# EAGLE schematic hw_LM (EAGLE 7.6.0), part 2 of 3
## Sheet 4 of 9: S32 Signals
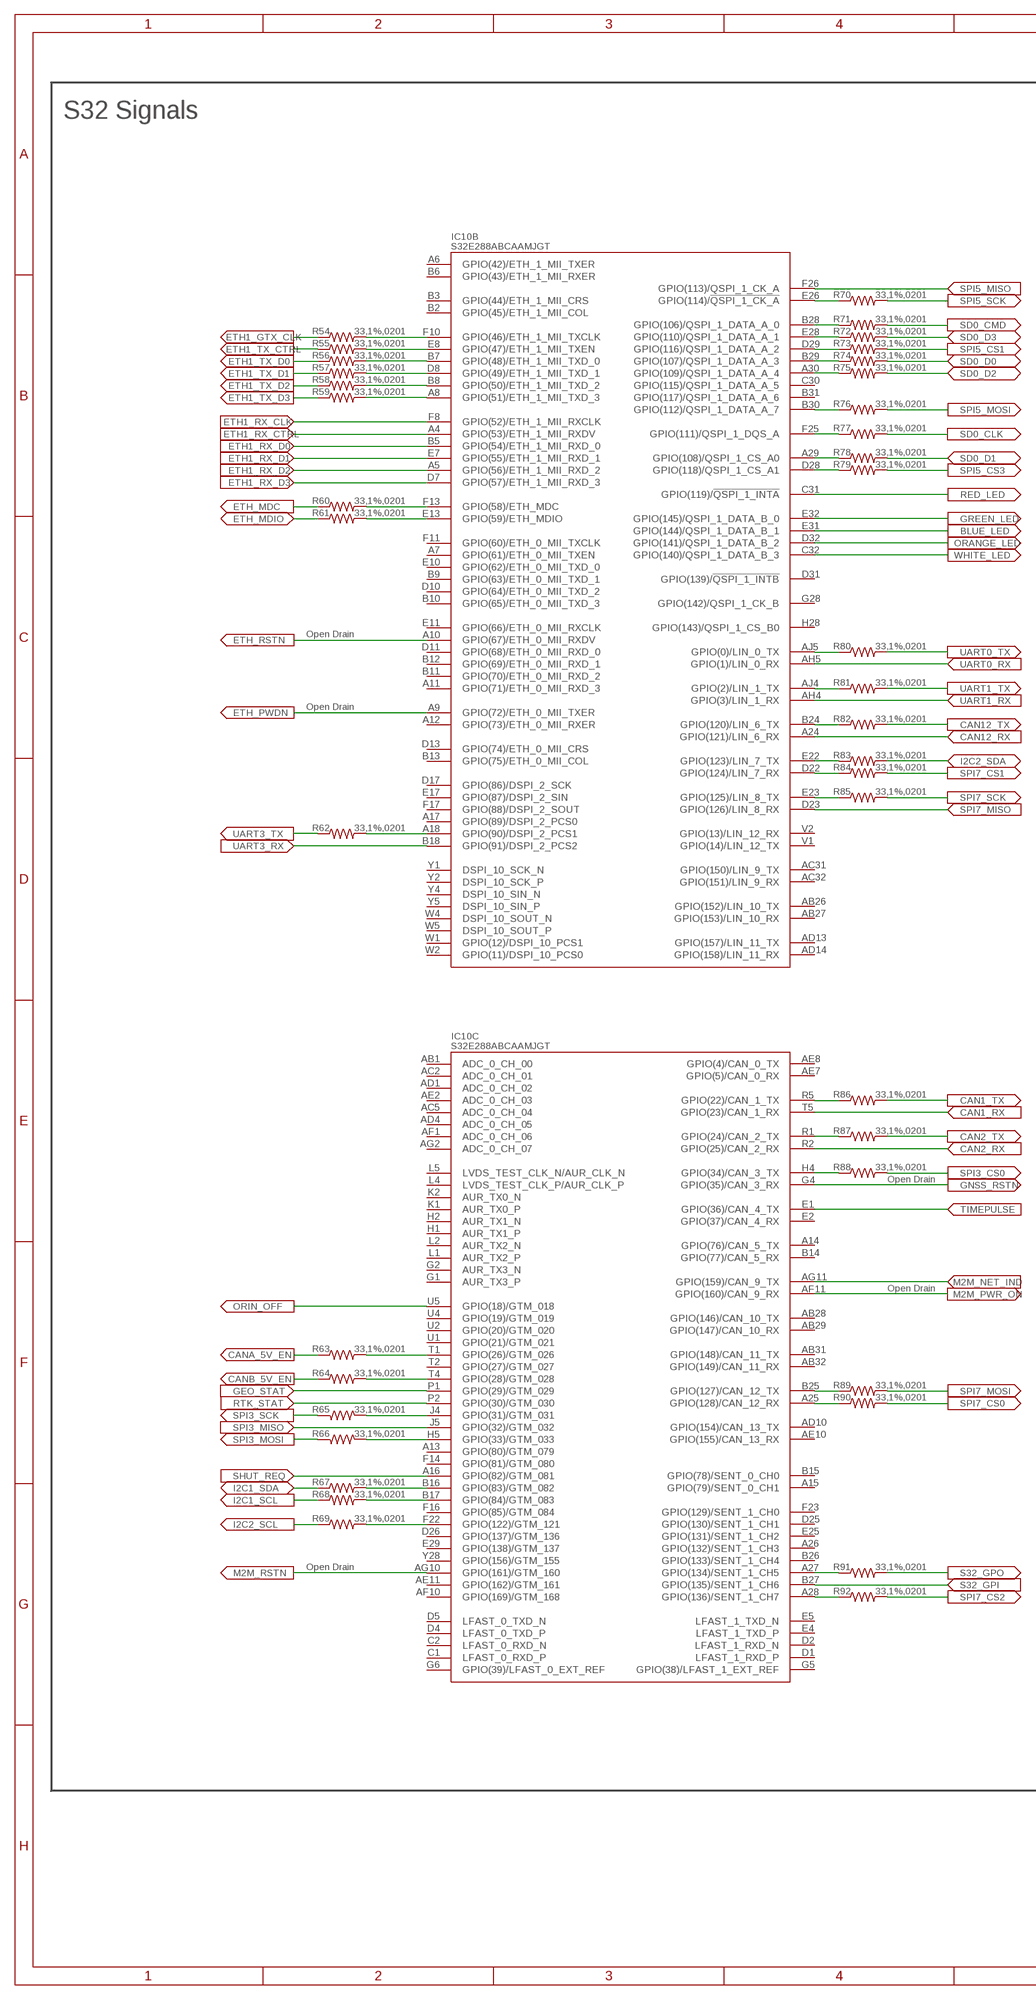
[diagram p5: schematic, sheet 4, part 1 of 2]
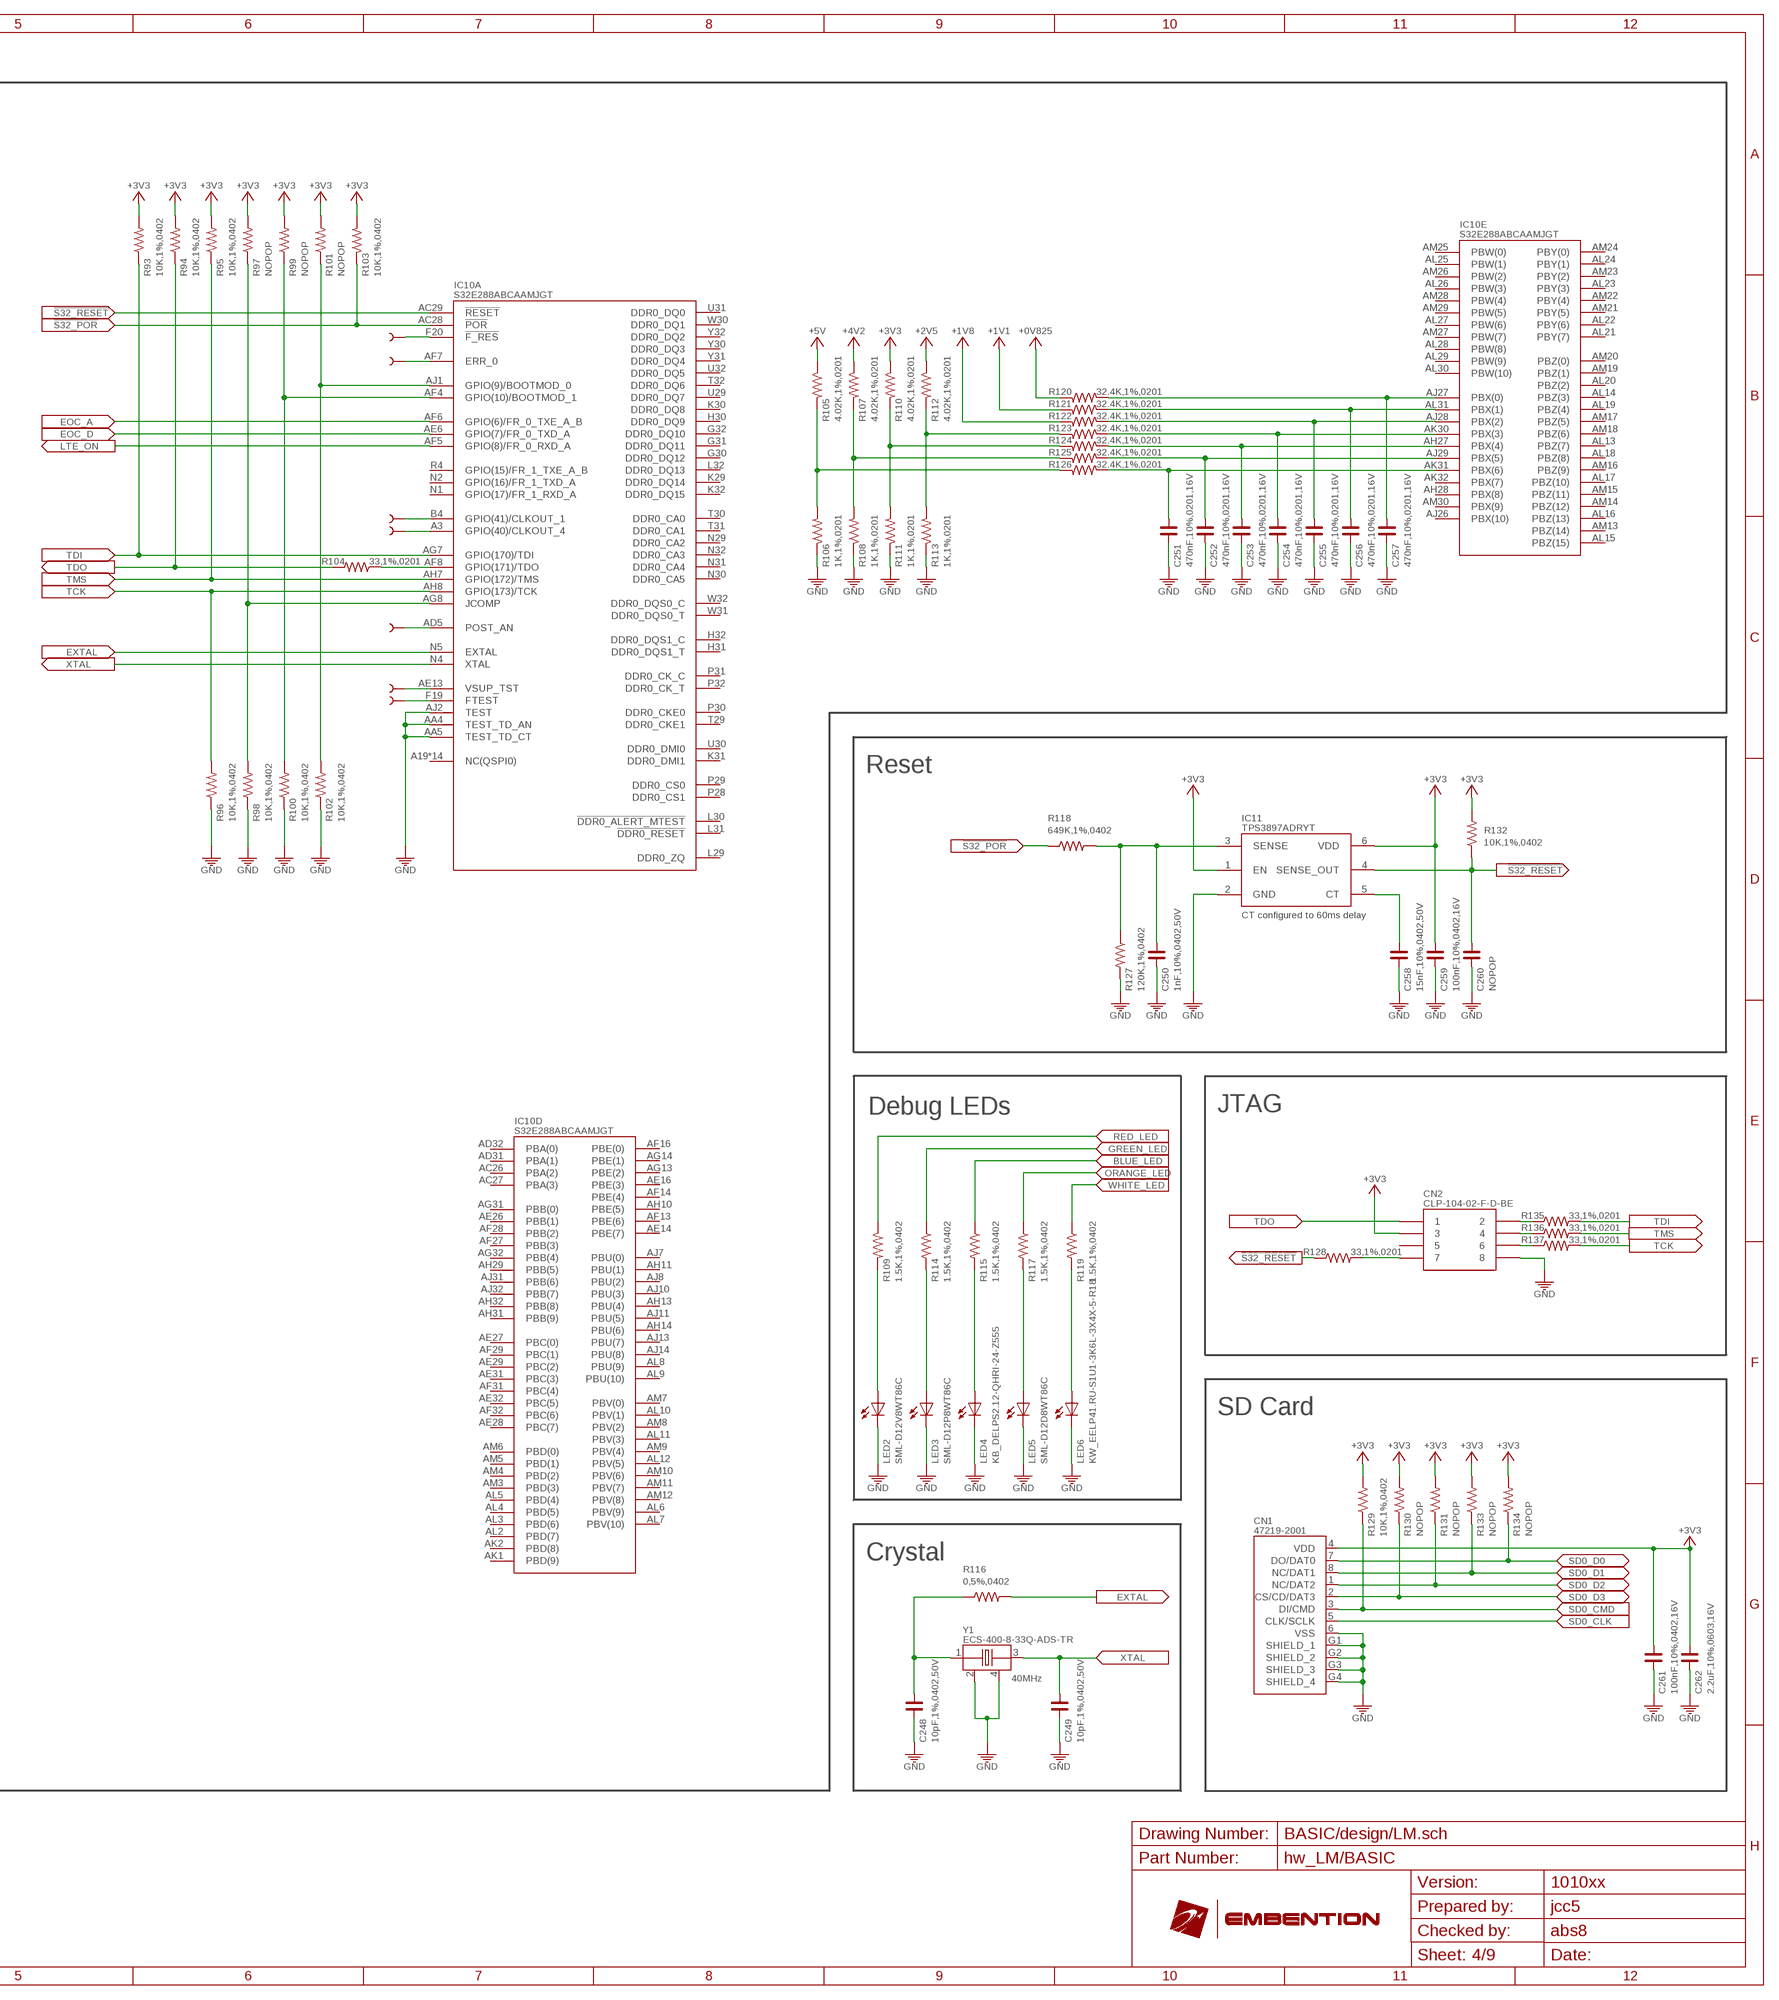
[diagram p6: schematic, sheet 4, part 2 of 2]

### Parts
C248  10pF,1%,0402,50V  C_0402  [C0402]
C249  10pF,1%,0402,50V  C_0402  [C0402]
C250  1nF,10%,0402,50V  C_0402  [C0402]
C251  470nF,10%,0201,16V  C_0201  [C0201]
C252  470nF,10%,0201,16V  C_0201  [C0201]
C253  470nF,10%,0201,16V  C_0201  [C0201]
C254  470nF,10%,0201,16V  C_0201  [C0201]
C255  470nF,10%,0201,16V  C_0201  [C0201]
C256  470nF,10%,0201,16V  C_0201  [C0201]
C257  470nF,10%,0201,16V  C_0201  [C0201]
C258  15nF,10%,0402,50V  C_0402  [C0402]
C259  100nF,10%,0402,16V  C_0402  [C0402]
C260  NOPOP  C_0402  [C0402]
C261  100nF,10%,0402,16V  C_0402  [C0402]
C262  2.2uF,10%,0603,16V  C_0603  [C0603]
CN1  47219-2001  SD-LATCH  [SD-LATCH]
CN2  CLP-104-02-F-D-BE  [CLP-104-02-X-D-BE]
IC11  TPS3897ADRYT  TPS3895ADRY  [USON6]
LED2  SML-D12V8WT86C  LED0603  [LED-0603]
LED3  SML-D12P8WT86C  LED0603  [LED-0603]
LED4  KB_DELPS2.12-QHRI-24-Z555  LED0603  [LED-0603]
LED5  SML-D12D8WT86C  LED0603  [LED-0603]
LED6  KW_EELP41.RU-S1U1-3K6L-3X4X-5-R18  LED0603  [LED-0603]
R54  33,1%,0201  R_0201  [R0201]
R55  33,1%,0201  R_0201  [R0201]
R56  33,1%,0201  R_0201  [R0201]
R57  33,1%,0201  R_0201  [R0201]
R58  33,1%,0201  R_0201  [R0201]
R59  33,1%,0201  R_0201  [R0201]
R60  33,1%,0201  R_0201  [R0201]
R61  33,1%,0201  R_0201  [R0201]
R62  33,1%,0201  R_0201  [R0201]
R63  33,1%,0201  R_0201  [R0201]
R64  33,1%,0201  R_0201  [R0201]
R65  33,1%,0201  R_0201  [R0201]
R66  33,1%,0201  R_0201  [R0201]
R67  33,1%,0201  R_0201  [R0201]
R68  33,1%,0201  R_0201  [R0201]
R69  33,1%,0201  R_0201  [R0201]
R70  33,1%,0201  R_0201  [R0201]
R71  33,1%,0201  R_0201  [R0201]
R72  33,1%,0201  R_0201  [R0201]
R73  33,1%,0201  R_0201  [R0201]
R74  33,1%,0201  R_0201  [R0201]
R75  33,1%,0201  R_0201  [R0201]
R76  33,1%,0201  R_0201  [R0201]
R77  33,1%,0201  R_0201  [R0201]
R78  33,1%,0201  R_0201  [R0201]
R79  33,1%,0201  R_0201  [R0201]
R80  33,1%,0201  R_0201  [R0201]
R81  33,1%,0201  R_0201  [R0201]
R82  33,1%,0201  R_0201  [R0201]
R83  33,1%,0201  R_0201  [R0201]
R84  33,1%,0201  R_0201  [R0201]
R85  33,1%,0201  R_0201  [R0201]
R86  33,1%,0201  R_0201  [R0201]
R87  33,1%,0201  R_0201  [R0201]
R88  33,1%,0201  R_0201  [R0201]
R89  33,1%,0201  R_0201  [R0201]
R90  33,1%,0201  R_0201  [R0201]
R91  33,1%,0201  R_0201  [R0201]
R92  33,1%,0201  R_0201  [R0201]
R93  10K,1%,0402  R_0402  [R0402]
R94  10K,1%,0402  R_0402  [R0402]
R95  10K,1%,0402  R_0402  [R0402]
R96  10K,1%,0402  R_0402  [R0402]
R97  NOPOP  R_0402  [R0402]
R98  10K,1%,0402  R_0402  [R0402]
R99  NOPOP  R_0402  [R0402]
R100  10K,1%,0402  R_0402  [R0402]
R101  NOPOP  R_0402  [R0402]
R102  10K,1%,0402  R_0402  [R0402]
R103  10K,1%,0402  R_0402  [R0402]
R104  33,1%,0201  R_0201  [R0201]
R105  4.02K,1%,0201  R_0201  [R0201]
R106  1K,1%,0201  R_0201  [R0201]
R107  4.02K,1%,0201  R_0201  [R0201]
R108  1K,1%,0201  R_0201  [R0201]
R109  1.5K,1%,0402  R_0402  [R0402]
R110  4.02K,1%,0201  R_0201  [R0201]
R111  1K,1%,0201  R_0201  [R0201]
R112  4.02K,1%,0201  R_0201  [R0201]
R113  1K,1%,0201  R_0201  [R0201]
R114  1.5K,1%,0402  R_0402  [R0402]
R115  1.5K,1%,0402  R_0402  [R0402]
R116  0,5%,0402  R_0402  [R0402]
R117  1.5K,1%,0402  R_0402  [R0402]
R118  649K,1%,0402  R_0402  [R0402]
R119  1.5K,1%,0402  R_0402  [R0402]
R120  32.4K,1%,0201  R_0201  [R0201]
R121  32.4K,1%,0201  R_0201  [R0201]
R122  32.4K,1%,0201  R_0201  [R0201]
R123  32.4K,1%,0201  R_0201  [R0201]
R124  32.4K,1%,0201  R_0201  [R0201]
R125  32.4K,1%,0201  R_0201  [R0201]
R126  32.4K,1%,0201  R_0201  [R0201]
R127  120K,1%,0402  R_0402  [R0402]
R128  33,1%,0201  R_0201  [R0201]
R129  10K,1%,0402  R_0402  [R0402]
R130  NOPOP  R_0402  [R0402]
R131  NOPOP  R_0402  [R0402]
R132  10K,1%,0402  R_0402  [R0402]
R133  NOPOP  R_0402  [R0402]
R134  NOPOP  R_0402  [R0402]
R135  33,1%,0201  R_0201  [R0201]
R136  33,1%,0201  R_0201  [R0201]
R137  33,1%,0201  R_0201  [R0201]
TP3  NOPOP  TEST-POINT2  [PAD.02X.02]
TP4  NOPOP  TEST-POINT2  [PAD.02X.02]
TP5  NOPOP  TEST-POINT2  [PAD.02X.02]
TP6  NOPOP  TEST-POINT2  [PAD.02X.02]
TP7  NOPOP  TEST-POINT2  [PAD.02X.02]
TP8  NOPOP  TEST-POINT2  [PAD.02X.02]
TP9  NOPOP  TEST-POINT2  [PAD.02X.02]
Y1  ECS-400-8-33Q-ADS-TR  ECS-250-18-33Q-DS-TR3  [ECS-250-18-33Q-DS-TR3]

### Nets
0V825_ADC: C257.1 IC10.AJ27(E:PBX(0)) R120.2
1V1_ADC: C256.1 IC10.AL31(E:PBX(1)) R121.2
1V8_ADC: C255.1 IC10.AJ28(E:PBX(2)) R122.2
2V5_ADC: C254.1 IC10.AK30(E:PBX(3)) R123.2
3V3_ADC: C253.1 IC10.AH27(E:PBX(4)) R124.2
4V2_ADC: C252.1 IC10.AJ29(E:PBX(5)) R125.2
5V_ADC: C251.1 IC10.AK31(E:PBX(6)) R126.2
!F_RES: IC10.F20(A:!F_RES) TP3.P$1
!S32_POR: IC10.AC28(A:!POR) R103.1 R118.1 ; also sheet 2
!S32_RESET: C260.1 IC10.AC29(A:!RESET) IC11.4(SENSE_OUT) R128.1 R132.1
+0V825: R120.1 ; also sheet 2,3
+1V1: R121.1 ; also sheet 2,3,6
+1V8: R122.1 ; also sheet 2,3,5,6
+2V5: R112.1 ; also sheet 2,6
+3V3: C259.1 C261.1 C262.1 CN1.4(VDD) CN2.3 IC11.1(EN) IC11.6(VDD) R93.2 R94.2 R95.2 R97.2 R99.2 R101.2 R103.2 R110.1 R129.2 R130.2 R131.2 R132.2 R133.2 R134.2 ; also sheet 2,3,5,7,8,9
+4V2: R107.1 ; also sheet 2,8
+5V: R105.1 ; also sheet 2,5,7,8
BLUE_LED: IC10.E31(B:GPIO(144)/QSPI_1_DATA_B_1) R115.1
BOOTMOD_0: IC10.AJ1(A:GPIO(9)/BOOTMOD_0) R101.1 R102.2
BOOTMOD_1: IC10.AF4(A:GPIO(10)/BOOTMOD_1) R99.1 R100.2
CAN1_RX: IC10.T5(C:GPIO(23)/CAN_1_RX) ; also sheet 7
CAN1_TX: R86.2 ; also sheet 7
CAN2_RX: IC10.R2(C:GPIO(25)/CAN_2_RX) ; also sheet 7
CAN2_TX: R87.2 ; also sheet 7
CAN12_RX: IC10.A24(B:GPIO(121)/LIN_6_RX) ; also sheet 7
CAN12_TX: R82.2 ; also sheet 7
CANA_5V_EN: R63.1 ; also sheet 7
CANB_5V_EN: R64.1 ; also sheet 7
CLKOUT_1: IC10.B4(A:GPIO(41)/CLKOUT_1) TP5.P$1
CLKOUT_4: IC10.A3(A:GPIO(40)/CLKOUT_4) TP6.P$1
EOC_A: IC10.AF6(A:GPIO(6)/FR_0_TXE_A_B) ; also sheet 9
EOC_D: IC10.AE6(A:GPIO(7)/FR_0_TXD_A) ; also sheet 9
ERR_0: IC10.AF7(A:ERR_0) TP4.P$1
ETH1_GTX_CLK [50R]: R54.1 ; also sheet 6
ETH1_RX_CLK [50R]: IC10.F8(B:GPIO(52)/ETH_1_MII_RXCLK) ; also sheet 6
ETH1_RX_CTRL [50R]: IC10.A4(B:GPIO(53)/ETH_1_MII_RXDV) ; also sheet 6
ETH1_RX_D0 [50R]: IC10.B5(B:GPIO(54)/ETH_1_MII_RXD_0) ; also sheet 6
ETH1_RX_D1 [50R]: IC10.E7(B:GPIO(55)/ETH_1_MII_RXD_1) ; also sheet 6
ETH1_RX_D2 [50R]: IC10.A5(B:GPIO(56)/ETH_1_MII_RXD_2) ; also sheet 6
ETH1_RX_D3 [50R]: IC10.D7(B:GPIO(57)/ETH_1_MII_RXD_3) ; also sheet 6
ETH1_TX_CTRL [50R]: R55.1 ; also sheet 6
ETH1_TX_D0 [50R]: R56.1 ; also sheet 6
ETH1_TX_D1 [50R]: R57.1 ; also sheet 6
ETH1_TX_D2 [50R]: R58.1 ; also sheet 6
ETH1_TX_D3 [50R]: R59.1 ; also sheet 6
ETH_MDC: R60.1 ; also sheet 6
ETH_MDIO: R61.1 ; also sheet 6
ETH_PWDN: IC10.A9(B:GPIO(72)/ETH_0_MII_TXER) ; also sheet 6
ETH_RSTN: IC10.A10(B:GPIO(67)/ETH_0_MII_RXDV) ; also sheet 6
EXTAL: IC10.N5(A:EXTAL) R116.2
FTEST: IC10.F19(A:FTEST) TP9.P$1
GEO_STAT: IC10.P1(C:GPIO(29)/GTM_029) ; also sheet 8
GND: C248.2 C249.2 C250.2 C251.2 C252.2 C253.2 C254.2 C255.2 C256.2 C257.2 C258.2 C259.2 C260.2 C261.2 C262.2 CN1.6(VSS) CN1.G1(SHIELD_1) CN1.G2(SHIELD_2) CN1.G3(SHIELD_3) CN1.G4(SHIELD_4) CN2.8 IC10.AA4(A:TEST_TD_AN) IC10.AA5(A:TEST_TD_CT) IC10.AJ2(A:TEST) IC11.2(GND) LED2.C LED3.C LED4.C LED5.C LED6.C R96.1 R98.1 R100.1 R102.1 R106.1 R108.1 R111.1 R113.1 R127.2 Y1.2(GND_2) Y1.4(GND_4) ; also sheet 1,2,3,5,6,7,8,9
GNSS_RSTN: IC10.G4(C:GPIO(35)/CAN_3_RX) ; also sheet 8
GPIO0: IC10.AJ5(B:GPIO(0)/LIN_0_TX) R80.1
GPIO2: IC10.AJ4(B:GPIO(2)/LIN_1_TX) R81.1
GPIO22: IC10.R5(C:GPIO(22)/CAN_1_TX) R86.1
GPIO24: IC10.R1(C:GPIO(24)/CAN_2_TX) R87.1
GPIO26: IC10.T1(C:GPIO(26)/GTM_026) R63.2
GPIO28: IC10.T4(C:GPIO(28)/GTM_028) R64.2
GPIO31: IC10.J4(C:GPIO(31)/GTM_031) R65.2
GPIO33: IC10.H5(C:GPIO(33)/GTM_033) R66.2
GPIO34: IC10.H4(C:GPIO(34)/CAN_3_TX) R88.1
GPIO46 [50R]: IC10.F10(B:GPIO(46)/ETH_1_MII_TXCLK) R54.2
GPIO47 [50R]: IC10.E8(B:GPIO(47)/ETH_1_MII_TXEN) R55.2
GPIO48 [50R]: IC10.B7(B:GPIO(48)/ETH_1_MII_TXD_0) R56.2
GPIO49 [50R]: IC10.D8(B:GPIO(49)/ETH_1_MII_TXD_1) R57.2
GPIO50 [50R]: IC10.B8(B:GPIO(50)/ETH_1_MII_TXD_2) R58.2
GPIO51 [50R]: IC10.A8(B:GPIO(51)/ETH_1_MII_TXD_3) R59.2
GPIO58: IC10.F13(B:GPIO(58)/ETH_MDC) R60.2
GPIO59: IC10.E13(B:GPIO(59)/ETH_MDIO) R61.2
GPIO83: IC10.B16(C:GPIO(83)/GTM_082) R67.2
GPIO84: IC10.B17(C:GPIO(84)/GTM_083) R68.2
GPIO90: IC10.A18(B:GPIO(90)/DSPI_2_PCS1) R62.2
GPIO106: IC10.B28(B:GPIO(106)/QSPI_1_DATA_A_0) R71.1
GPIO107: IC10.B29(B:GPIO(107)/QSPI_1_DATA_A_3) R74.1
GPIO108: IC10.A29(B:GPIO(108)/QSPI_1_CS_A0) R78.1
GPIO109: IC10.A30(B:GPIO(109)/QSPI_1_DATA_A_4) R75.1
GPIO110: IC10.E28(B:GPIO(110)/QSPI_1_DATA_A_1) R72.1
GPIO111: IC10.F25(B:GPIO(111)/QSPI_1_DQS_A) R77.1
GPIO112: IC10.B30(B:GPIO(112)/QSPI_1_DATA_A_7) R76.1
GPIO114: IC10.E26(B:GPIO(114)/!QSPI_1_CK_A) R70.1
GPIO116: IC10.D29(B:GPIO(116)/QSPI_1_DATA_A_2) R73.1
GPIO118: IC10.D28(B:GPIO(118)/QSPI_1_CS_A1) R79.1
GPIO120: IC10.B24(B:GPIO(120)/LIN_6_TX) R82.1
GPIO122: IC10.F22(C:GPIO(122)/GTM_121) R69.2
GPIO123: IC10.E22(B:GPIO(123)/LIN_7_TX) R83.1
GPIO124: IC10.D22(B:GPIO(124)/LIN_7_RX) R84.1
GPIO125: IC10.E23(B:GPIO(125)/LIN_8_TX) R85.1
GPIO127: IC10.B25(C:GPIO(127)/CAN_12_TX) R89.1
GPIO128: IC10.A25(C:GPIO(128)/CAN_12_RX) R90.1
GPIO134: IC10.A27(C:GPIO(134)/SENT_1_CH5) R91.1
GPIO136: IC10.A28(C:GPIO(136)/SENT_1_CH7) R92.1
GPIO171: IC10.AF8(A:GPIO(171)/TDO) R104.2
GREEN_LED: IC10.E32(B:GPIO(145)/QSPI_1_DATA_B_0) R114.1
I2C1_SCL: R68.1 ; also sheet 9
I2C1_SDA: R67.1 ; also sheet 9
I2C2_SCL: R69.1 ; also sheet 9
I2C2_SDA: R83.2 ; also sheet 9
JCOMP: IC10.AG8(A:JCOMP) R97.1 R98.2
JRSTN: CN2.7 R128.2
JTCK: CN2.6 R137.1
JTDI: CN2.2 R135.1
JTMS: CN2.4 R136.1
LTE_ON: IC10.AF5(A:GPIO(8)/FR_0_RXD_A) ; also sheet 2
M2M_NET_IND: IC10.AG11(C:GPIO(159)/CAN_9_TX) ; also sheet 8
M2M_PWR_ON: IC10.AF11(C:GPIO(160)/CAN_9_RX) ; also sheet 8
M2M_RSTN: IC10.AG10(C:GPIO(161)/GTM_160) ; also sheet 8
N$9: R112.2 R113.2 R123.1
N$35: R107.2 R108.2 R125.1
N$135: LED2.A R109.2
N$142: LED3.A R114.2
N$240: LED4.A R115.2
N$241: R110.2 R111.2 R124.1
N$716: C250.1 IC11.3(SENSE) R118.2 R127.1
N$728: C258.1 IC11.5(CT)
N$769: C248.1 R116.1 Y1.1(Q_1)
N$1161: LED5.A R117.2
N$1162: LED6.A R119.2
N$1165: R105.2 R106.2 R126.1
ORANGE_LED: IC10.D32(B:GPIO(141)/QSPI_1_DATA_B_2) R117.1
ORIN_OFF: IC10.U5(C:GPIO(18)/GTM_018) ; also sheet 2
POST_AN: IC10.AD5(A:POST_AN) TP7.P$1
RED_LED: IC10.C31(B:GPIO(119)/!QSPI_1_INTA) R109.1
RTK_STAT: IC10.P2(C:GPIO(30)/GTM_030) ; also sheet 8
S32_GPI: IC10.B27(C:GPIO(135)/SENT_1_CH6) ; also sheet 5
S32_GPO: R91.2 ; also sheet 5
SD0_CLK: CN1.5(CLK/SCLK) R77.2
SD0_CMD: CN1.3(DI/CMD) R71.2 R129.1
SD0_D0: CN1.7(DO/DAT0) R74.2 R134.1
SD0_D1: CN1.8(NC/DAT1) R78.2 R133.1
SD0_D2: CN1.1(NC/DAT2) R75.2 R131.1
SD0_D3: CN1.2(CS/CD/DAT3) R72.2 R130.1
SHUT_REQ: IC10.A16(C:GPIO(82)/GTM_081) ; also sheet 5
SPI3_CS0: R88.2 ; also sheet 8
SPI3_MISO: IC10.J5(C:GPIO(32)/GTM_032) ; also sheet 8
SPI3_MOSI: R66.1 ; also sheet 8
SPI3_SCK: R65.1 ; also sheet 8
SPI5_CS1: R73.2 ; also sheet 9
SPI5_CS3: R79.2 ; also sheet 9
SPI5_MISO: IC10.F26(B:GPIO(113)/QSPI_1_CK_A) ; also sheet 9
SPI5_MOSI: R76.2 ; also sheet 9
SPI5_SCK: R70.2 ; also sheet 9
SPI7_CS0: R90.2 ; also sheet 9
SPI7_CS1: R84.2 ; also sheet 9
SPI7_CS2: R92.2 ; also sheet 9
SPI7_MISO: IC10.D23(B:GPIO(126)/LIN_8_RX) ; also sheet 9
SPI7_MOSI: R89.2 ; also sheet 9
SPI7_SCK: R85.2 ; also sheet 9
TCK: IC10.AH8(A:GPIO(173)/TCK) R96.2 R137.2
TDI: IC10.AG7(A:GPIO(170)/TDI) R93.1 R135.2
TDO: CN2.1 R94.1 R104.1
TIMEPULSE: IC10.E1(C:GPIO(36)/CAN_4_TX) ; also sheet 8
TMS: IC10.AH7(A:GPIO(172)/TMS) R95.1 R136.2
UART0_RX: IC10.AH5(B:GPIO(1)/LIN_0_RX) ; also sheet 8
UART0_TX: R80.2 ; also sheet 8
UART1_RX: IC10.AH4(B:GPIO(3)/LIN_1_RX) ; also sheet 8
UART1_TX: R81.2 ; also sheet 8
UART3_RX: IC10.B18(B:GPIO(91)/DSPI_2_PCS2) ; also sheet 5
UART3_TX: R62.1 ; also sheet 5
VSUP_TST: IC10.AE13(A:VSUP_TST) TP8.P$1
WHITE_LED: IC10.C32(B:GPIO(140)/QSPI_1_DATA_B_3) R119.1
XTAL: C249.1 IC10.N4(A:XTAL) Y1.3(Q_3)
Unconnected: CN2.5 IC10.A6(B:GPIO(42)/ETH_1_MII_TXER) IC10.A7(B:GPIO(61)/ETH_0_MII_TXEN) IC10.A11(B:GPIO(71)/ETH_0_MII_RXD_3) IC10.A12(B:GPIO(73)/ETH_0_MII_RXER) IC10.A13(C:GPIO(80)/GTM_079) IC10.A14(C:GPIO(76)/CAN_5_TX) IC10.A15(C:GPIO(79)/SENT_0_CH1) IC10.A17(B:GPIO(89)/DSPI_2_PCS0) IC10.A19(A:NC(QSPI0)) IC10.A20(A:NC(QSPI0)) IC10.A21(A:NC(QSPI0)) IC10.A22(A:NC(QSPI0)) IC10.A23(A:NC(QSPI0)) IC10.A26(C:GPIO(132)/SENT_1_CH3) IC10.AB1(C:ADC_0_CH_00) IC10.AB26(B:GPIO(152)/LIN_10_TX) IC10.AB27(B:GPIO(153)/LIN_10_RX) IC10.AB28(C:GPIO(146)/CAN_10_TX) IC10.AB29(C:GPIO(147)/CAN_10_RX) IC10.AB31(C:GPIO(148)/CAN_11_TX) IC10.AB32(C:GPIO(149)/CAN_11_RX) IC10.AC2(C:ADC_0_CH_01) IC10.AC5(C:ADC_0_CH_04) IC10.AC26(D:PBA(2)) IC10.AC27(D:PBA(3)) IC10.AC31(B:GPIO(150)/LIN_9_TX) IC10.AC32(B:GPIO(151)/LIN_9_RX) IC10.AD1(C:ADC_0_CH_02) IC10.AD4(C:ADC_0_CH_05) IC10.AD10(C:GPIO(154)/CAN_13_TX) IC10.AD13(B:GPIO(157)/LIN_11_TX) IC10.AD14(B:GPIO(158)/LIN_11_RX) IC10.AD31(D:PBA(1)) IC10.AD32(D:PBA(0)) IC10.AE2(C:ADC_0_CH_03) IC10.AE7(C:GPIO(5)/CAN_0_RX) IC10.AE8(C:GPIO(4)/CAN_0_TX) IC10.AE10(C:GPIO(155)/CAN_13_RX) IC10.AE11(C:GPIO(162)/GTM_161) IC10.AE14(D:PBE(7)) IC10.AE16(D:PBE(3)) IC10.AE26(D:PBB(1)) IC10.AE27(D:PBC(0)) IC10.AE28(D:PBC(7)) IC10.AE29(D:PBC(2)) IC10.AE31(D:PBC(3)) IC10.AE32(D:PBC(5)) IC10.AF1(C:ADC_0_CH_06) IC10.AF10(C:GPIO(169)/GTM_168) IC10.AF13(D:PBE(6)) IC10.AF14(D:PBE(4)) IC10.AF16(D:PBE(0)) IC10.AF27(D:PBB(3)) IC10.AF28(D:PBB(2)) IC10.AF29(D:PBC(1)) IC10.AF31(D:PBC(4)) IC10.AF32(D:PBC(6)) IC10.AG2(C:ADC_0_CH_07) IC10.AG13(D:PBE(2)) IC10.AG14(D:PBE(1)) IC10.AG31(D:PBB(0)) IC10.AG32(D:PBB(4)) IC10.AH10(D:PBE(5)) IC10.AH11(D:PBU(1)) IC10.AH13(D:PBU(4)) IC10.AH14(D:PBU(6)) IC10.AH28(E:PBX(8)) IC10.AH29(D:PBB(5)) IC10.AH31(D:PBB(9)) IC10.AH32(D:PBB(8)) IC10.AJ7(D:PBU(0)) IC10.AJ8(D:PBU(2)) IC10.AJ10(D:PBU(3)) IC10.AJ11(D:PBU(5)) IC10.AJ13(D:PBU(7)) IC10.AJ14(D:PBU(8)) IC10.AJ26(E:PBX(10)) IC10.AJ31(D:PBB(6)) IC10.AJ32(D:PBB(7)) IC10.AK1(D:PBD(9)) IC10.AK2(D:PBD(8)) IC10.AK32(E:PBX(7)) IC10.AL2(D:PBD(7)) IC10.AL3(D:PBD(6)) IC10.AL4(D:PBD(5)) IC10.AL5(D:PBD(4)) IC10.AL6(D:PBV(9)) IC10.AL7(D:PBV(10)) IC10.AL8(D:PBU(9)) IC10.AL9(D:PBU(10)) IC10.AL10(D:PBV(1)) IC10.AL11(D:PBV(3)) IC10.AL12(D:PBV(5)) IC10.AL13(E:PBZ(7)) IC10.AL14(E:PBZ(3)) IC10.AL15(E:PBZ(15)) IC10.AL16(E:PBZ(13)) IC10.AL17(E:PBZ(10)) IC10.AL18(E:PBZ(8)) IC10.AL19(E:PBZ(4)) IC10.AL20(E:PBZ(2)) IC10.AL21(E:PBY(7)) IC10.AL22(E:PBY(6)) IC10.AL23(E:PBY(3)) IC10.AL24(E:PBY(1)) IC10.AL25(E:PBW(1)) IC10.AL26(E:PBW(3)) IC10.AL27(E:PBW(6)) IC10.AL28(E:PBW(8)) IC10.AL29(E:PBW(9)) IC10.AL30(E:PBW(10)) IC10.AM3(D:PBD(3)) IC10.AM4(D:PBD(2)) IC10.AM5(D:PBD(1)) IC10.AM6(D:PBD(0)) IC10.AM7(D:PBV(0)) IC10.AM8(D:PBV(2)) IC10.AM9(D:PBV(4)) IC10.AM10(D:PBV(6)) IC10.AM11(D:PBV(7)) IC10.AM12(D:PBV(8)) IC10.AM13(E:PBZ(14)) IC10.AM14(E:PBZ(12)) IC10.AM15(E:PBZ(11)) IC10.AM16(E:PBZ(9)) IC10.AM17(E:PBZ(5)) IC10.AM18(E:PBZ(6)) IC10.AM19(E:PBZ(1)) IC10.AM20(E:PBZ(0)) IC10.AM21(E:PBY(5)) IC10.AM22(E:PBY(4)) IC10.AM23(E:PBY(2)) IC10.AM24(E:PBY(0)) IC10.AM25(E:PBW(0)) IC10.AM26(E:PBW(2)) IC10.AM27(E:PBW(7)) IC10.AM28(E:PBW(4)) IC10.AM29(E:PBW(5)) IC10.AM30(E:PBX(9)) IC10.B2(B:GPIO(45)/ETH_1_MII_COL) IC10.B3(B:GPIO(44)/ETH_1_MII_CRS) IC10.B6(B:GPIO(43)/ETH_1_MII_RXER) IC10.B9(B:GPIO(63)/ETH_0_MII_TXD_1) IC10.B10(B:GPIO(65)/ETH_0_MII_TXD_3) IC10.B11(B:GPIO(70)/ETH_0_MII_RXD_2) IC10.B12(B:GPIO(69)/ETH_0_MII_RXD_1) IC10.B13(B:GPIO(75)/ETH_0_MII_COL) IC10.B14(C:GPIO(77)/CAN_5_RX) IC10.B15(C:GPIO(78)/SENT_0_CH0) IC10.B19(A:NC(QSPI0)) IC10.B20(A:NC(QSPI0)) IC10.B21(A:NC(QSPI0)) IC10.B22(A:NC(QSPI0)) IC10.B23(A:NC(QSPI0)) IC10.B26(C:GPIO(133)/SENT_1_CH4) IC10.B31(B:GPIO(117)/QSPI_1_DATA_A_6) IC10.C1(C:LFAST_0_RXD_P) IC10.C2(C:LFAST_0_RXD_N) IC10.C30(B:GPIO(115)/QSPI_1_DATA_A_5) IC10.D1(C:LFAST_1_RXD_P) IC10.D2(C:LFAST_1_RXD_N) IC10.D4(C:LFAST_0_TXD_P) IC10.D5(C:LFAST_0_TXD_N) IC10.D10(B:GPIO(64)/ETH_0_MII_TXD_2) IC10.D11(B:GPIO(68)/ETH_0_MII_RXD_0) IC10.D13(B:GPIO(74)/ETH_0_MII_CRS) IC10.D17(B:GPIO(86)/DSPI_2_SCK) IC10.D19(A:NC(QSPI0)) IC10.D20(A:NC(QSPI0)) IC10.D25(C:GPIO(130)/SENT_1_CH1) IC10.D26(C:GPIO(137)/GTM_136) IC10.D31(B:GPIO(139)/!QSPI_1_INTB) IC10.E2(C:GPIO(37)/CAN_4_RX) IC10.E4(C:LFAST_1_TXD_P) IC10.E5(C:LFAST_1_TXD_N) IC10.E10(B:GPIO(62)/ETH_0_MII_TXD_0) IC10.E11(B:GPIO(66)/ETH_0_MII_RXCLK) IC10.E17(B:GPIO(87)/DSPI_2_SIN) IC10.E19(A:NC(QSPI0)) IC10.E20(A:NC(QSPI0)) IC10.E25(C:GPIO(131)/SENT_1_CH2) IC10.E29(C:GPIO(138)/GTM_137) IC10.F11(B:GPIO(60)/ETH_0_MII_TXCLK) IC10.F14(C:GPIO(81)/GTM_080) IC10.F16(C:GPIO(85)/GTM_084) IC10.F17(B:GPIO(88)/DSPI_2_SOUT) IC10.F23(C:GPIO(129)/SENT_1_CH0) IC10.G1(C:AUR_TX3_P) IC10.G2(C:AUR_TX3_N) IC10.G5(C:GPIO(38)/LFAST_1_EXT_REF) IC10.G6(C:GPIO(39)/LFAST_0_EXT_REF) IC10.G28(B:GPIO(142)/QSPI_1_CK_B) IC10.G30(A:DDR0_DQ12) IC10.G31(A:DDR0_DQ11) IC10.G32(A:DDR0_DQ10) IC10.H1(C:AUR_TX1_P) IC10.H2(C:AUR_TX1_N) IC10.H28(B:GPIO(143)/QSPI_1_CS_B0) IC10.H30(A:DDR0_DQ9) IC10.H31(A:DDR0_DQS1_T) IC10.H32(A:DDR0_DQS1_C) IC10.K1(C:AUR_TX0_P) IC10.K2(C:AUR_TX0_N) IC10.K29(A:DDR0_DQ14) IC10.K30(A:DDR0_DQ8) IC10.K31(A:DDR0_DMI1) IC10.K32(A:DDR0_DQ15) IC10.L1(C:AUR_TX2_P) IC10.L2(C:AUR_TX2_N) IC10.L4(C:LVDS_TEST_CLK_P/AUR_CLK_P) IC10.L5(C:LVDS_TEST_CLK_N/AUR_CLK_N) IC10.L29(A:DDR0_ZQ) IC10.L30(A:!DDR0_ALERT_MTEST) IC10.L31(A:!DDR0_RESET) IC10.L32(A:DDR0_DQ13) IC10.N1(A:GPIO(17)/FR_1_RXD_A) IC10.N2(A:GPIO(16)/FR_1_TXD_A) IC10.N29(A:DDR0_CA2) IC10.N30(A:DDR0_CA5) IC10.N31(A:DDR0_CA4) IC10.N32(A:DDR0_CA3) IC10.P28(A:DDR0_CS1) IC10.P29(A:DDR0_CS0) IC10.P30(A:DDR0_CKE0) IC10.P31(A:DDR0_CK_C) IC10.P32(A:DDR0_CK_T) IC10.R4(A:GPIO(15)/FR_1_TXE_A_B) IC10.T2(C:GPIO(27)/GTM_027) IC10.T29(A:DDR0_CKE1) IC10.T30(A:DDR0_CA0) IC10.T31(A:DDR0_CA1) IC10.T32(A:DDR0_DQ6) IC10.U1(C:GPIO(21)/GTM_021) IC10.U2(C:GPIO(20)/GTM_020) IC10.U4(C:GPIO(19)/GTM_019) IC10.U29(A:DDR0_DQ7) IC10.U30(A:DDR0_DMI0) IC10.U31(A:DDR0_DQ0) IC10.U32(A:DDR0_DQ5) IC10.V1(B:GPIO(14)/LIN_12_TX) IC10.V2(B:GPIO(13)/LIN_12_RX) IC10.W1(B:GPIO(12)/DSPI_10_PCS1) IC10.W2(B:GPIO(11)/DSPI_10_PCS0) IC10.W4(B:DSPI_10_SOUT_N) IC10.W5(B:DSPI_10_SOUT_P) IC10.W30(A:DDR0_DQ1) IC10.W31(A:DDR0_DQS0_T) IC10.W32(A:DDR0_DQS0_C) IC10.Y1(B:DSPI_10_SCK_N) IC10.Y2(B:DSPI_10_SCK_P) IC10.Y4(B:DSPI_10_SIN_N) IC10.Y5(B:DSPI_10_SIN_P) IC10.Y28(C:GPIO(156)/GTM_155) IC10.Y30(A:DDR0_DQ3) IC10.Y31(A:DDR0_DQ4) IC10.Y32(A:DDR0_DQ2)

### Notes on the sheet
- S32 Signals
- Open Drain
- Open Drain
- Reset
- CT configured to 60ms delay
- Debug LEDs | JTAG
- Open Drain
- Open Drain
- SD Card
- Crystal
- Open Drain
- 40MHz
- BASIC/design/LM.sch
- hw_LM/BASIC
- 1010xx
- jcc5
- abs8

## Sheet 5 of 9: Jetson Nano Orin
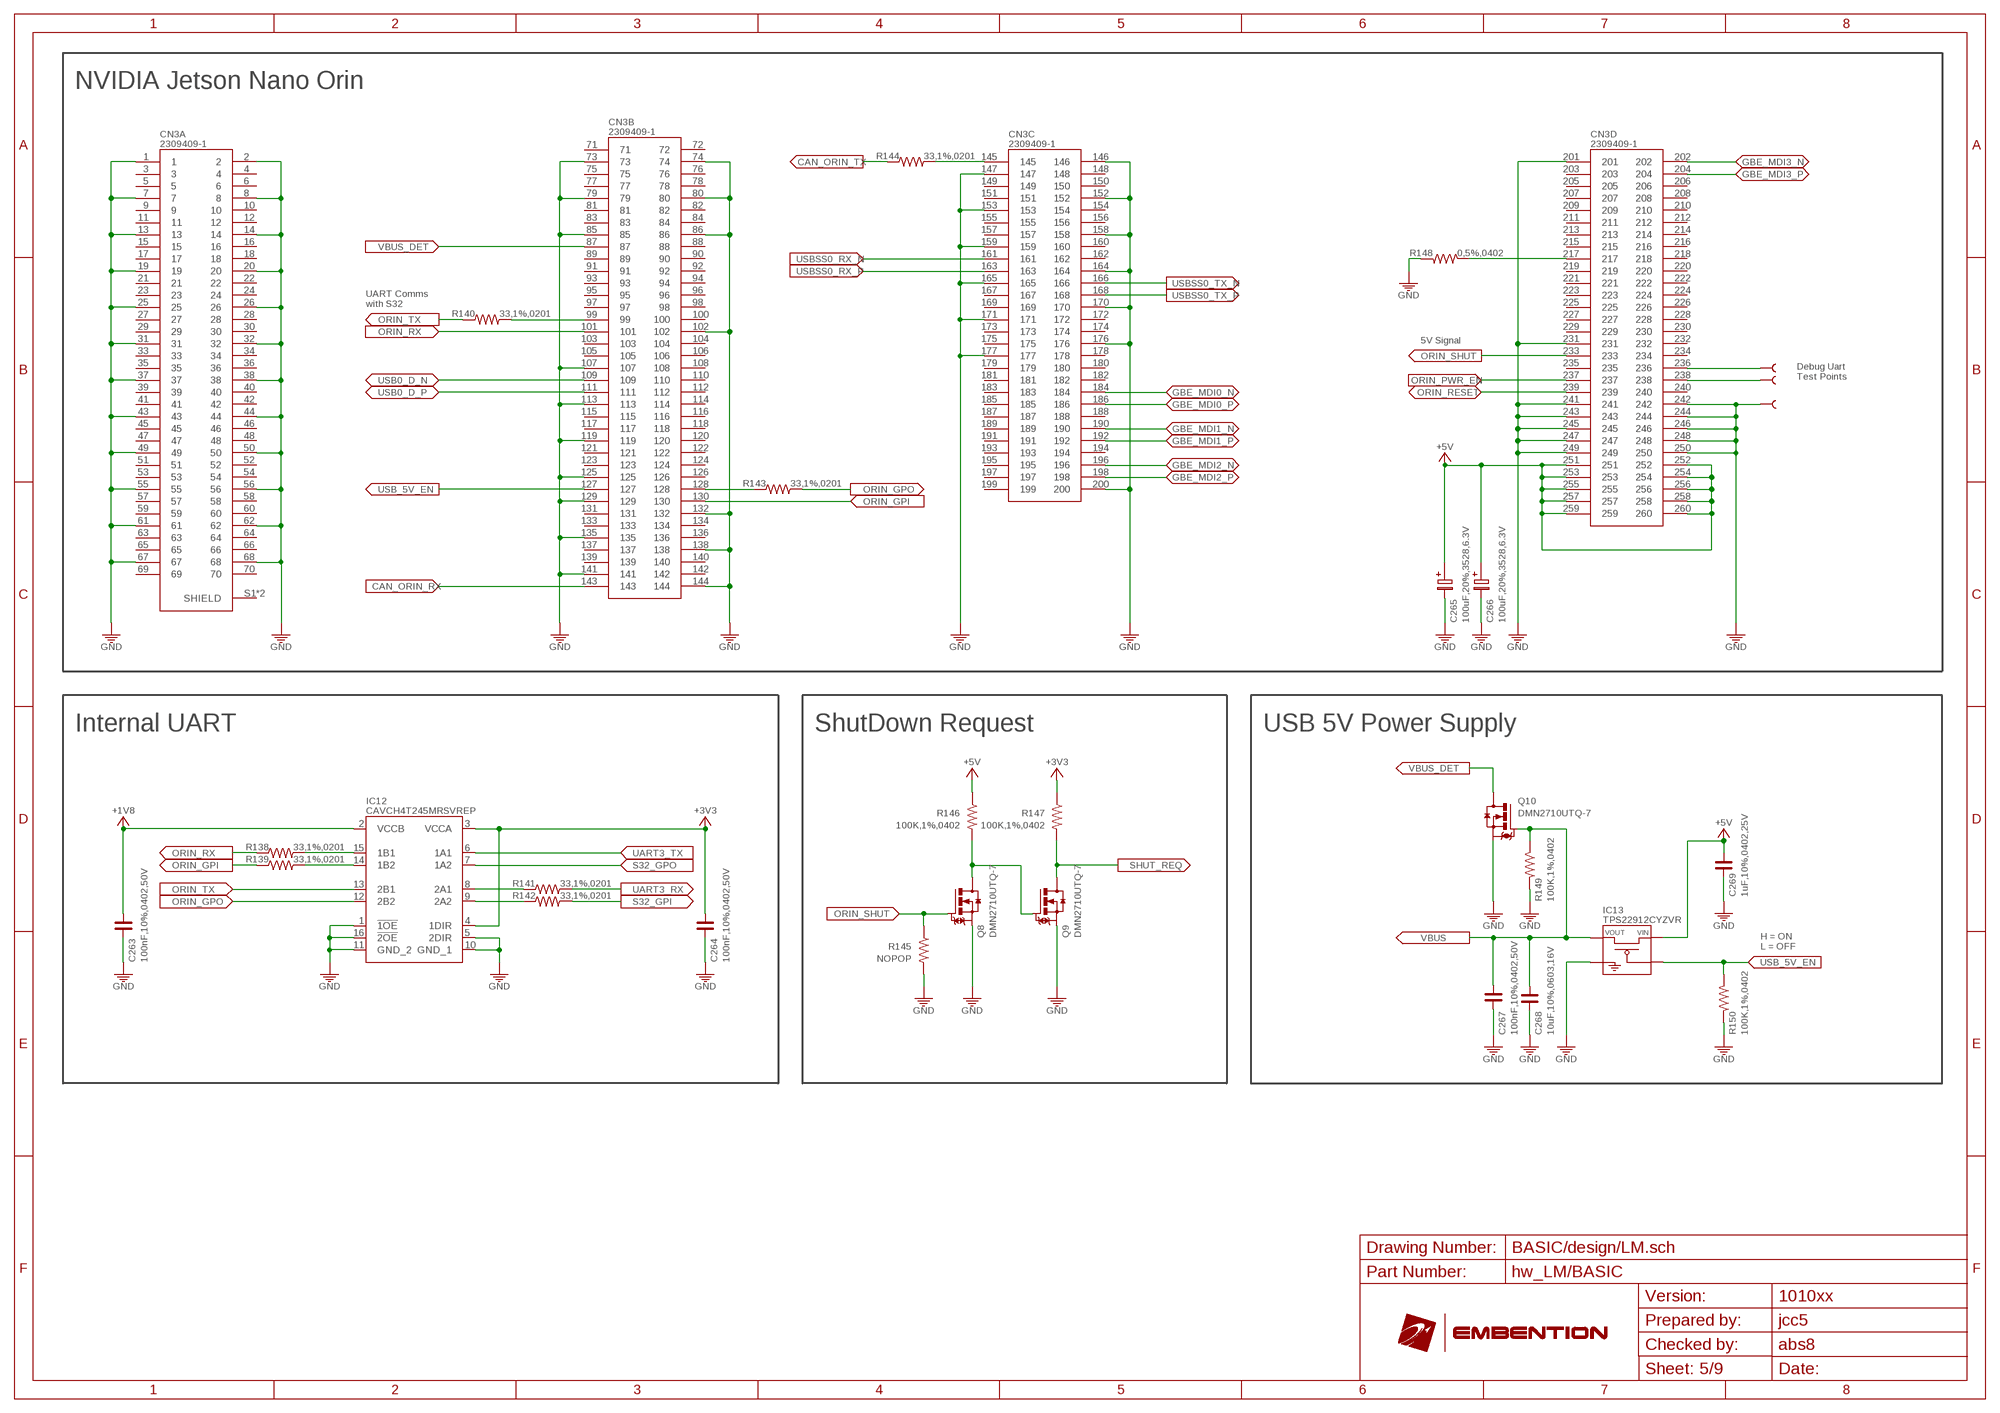
[diagram p7: schematic, sheet 5]

### Parts
C263  100nF,10%,0402,50V  C_0402  [C0402]
C264  100nF,10%,0402,50V  C_0402  [C0402]
C265  100uF,20%,3528,6.3V  C-PR-SMD-TE-B  [TE-B-3528]
C266  100uF,20%,3528,6.3V  C-PR-SMD-TE-B  [TE-B-3528]
C267  100nF,10%,0402,50V  C_0402  [C0402]
C268  10uF,10%,0603,16V  C_0603  [C0603]
C269  1uF,10%,0402,25V  C_0402  [C0402]
CN3  2309409-1  [TE_2309409-1]
IC12  CAVCH4T245MRSVREP  SN74AVCH4T245-EP  [UQFN-16]
IC13  TPS22912CYZVR  TPS2291XX  [DSBGA-4_YZV]
Q8  DMN2710UTQ-7  [SOT-523]
Q9  DMN2710UTQ-7  [SOT-523]
Q10  DMN2710UTQ-7  [SOT-523]
R138  33,1%,0201  R_0201  [R0201]
R139  33,1%,0201  R_0201  [R0201]
R140  33,1%,0201  R_0201  [R0201]
R141  33,1%,0201  R_0201  [R0201]
R142  33,1%,0201  R_0201  [R0201]
R143  33,1%,0201  R_0201  [R0201]
R144  33,1%,0201  R_0201  [R0201]
R145  NOPOP  R_0402  [R0402]
R146  100K,1%,0402  R_0402  [R0402]
R147  100K,1%,0402  R_0402  [R0402]
R148  0,5%,0402  R_0402  [R0402]
R149  100K,1%,0402  R_0402  [R0402]
R150  100K,1%,0402  R_0402  [R0402]
TP10  NOPOP  TEST-POINT2  [PAD.02X.02]
TP11  NOPOP  TEST-POINT2  [PAD.02X.02]
TP12  NOPOP  TEST-POINT2  [PAD.02X.02]

### Nets
+1V8: C263.2 IC12.2(VCCB) ; also sheet 2,3,4,6
+3V3: C264.2 IC12.3(VCCA) IC12.4(1DIR) R147.1 ; also sheet 2,3,4,7,8,9
+5V: C265.+ C266.+ C269.1 CN3.251 CN3.252 CN3.253 CN3.254 CN3.255 CN3.256 CN3.257 CN3.258 CN3.259 CN3.260 IC13.A2(VIN) R146.1 ; also sheet 2,4,7,8
CAN_ORIN_RX: CN3.143 ; also sheet 7
CAN_ORIN_TX: R144.1 ; also sheet 7
GBE_MDI0_N [100R]: CN3.184 ; also sheet 6
GBE_MDI0_P [100R]: CN3.186 ; also sheet 6
GBE_MDI1_N [100R]: CN3.190 ; also sheet 6
GBE_MDI1_P [100R]: CN3.192 ; also sheet 6
GBE_MDI2_N [100R]: CN3.196 ; also sheet 6
GBE_MDI2_P [100R]: CN3.198 ; also sheet 6
GBE_MDI3_N [100R]: CN3.202 ; also sheet 6
GBE_MDI3_P [100R]: CN3.204 ; also sheet 6
GND: C263.1 C264.1 C265.- C266.- C267.1 C268.1 C269.2 CN3.1 CN3.2 CN3.7 CN3.8 CN3.13 CN3.14 CN3.19 CN3.20 CN3.25 CN3.26 CN3.31 CN3.32 CN3.37 CN3.38 CN3.43 CN3.44 CN3.49 CN3.50 CN3.55 CN3.56 CN3.61 CN3.62 CN3.67 CN3.68 CN3.73 CN3.74 CN3.79 CN3.80 CN3.85 CN3.86 CN3.102 CN3.107 CN3.113 CN3.119 CN3.125 CN3.129 CN3.132 CN3.135 CN3.138 CN3.141 CN3.144 CN3.146 CN3.147 CN3.152 CN3.153 CN3.158 CN3.159 CN3.164 CN3.165 CN3.170 CN3.171 CN3.176 CN3.177 CN3.200 CN3.201 CN3.231 CN3.241 CN3.242 CN3.243 CN3.244 CN3.245 CN3.246 CN3.247 CN3.248 CN3.249 CN3.250 IC12.1(!1OE) IC12.5(2DIR) IC12.10(GND_1) IC12.11(GND_2) IC12.16(!2OE) IC13.B1(GND) Q8.2(S) Q9.2(S) Q10.2(S) R145.2 R148.1 R149.2 R150.2 TP12.P$1 ; also sheet 1,2,3,4,6,7,8,9
MODULE_ID: CN3.217 R148.2
N$13: IC12.14(1B2) R139.2
N$40: Q8.3(D) Q9.1(G) R146.2
N$44: IC12.15(1B1) R138.2
N$53: IC12.8(2A1) R141.1
N$55: IC12.9(2A2) R142.1
ORIN_CAN_TX: CN3.145 R144.2
ORIN_GPI: CN3.130 R139.1
ORIN_GPO: IC12.12(2B2) R143.2
ORIN_PWR_EN: CN3.237 ; also sheet 2
ORIN_RESET: CN3.239 ; also sheet 2
ORIN_RX: CN3.101 R138.1
ORIN_SHUT: CN3.233 Q8.1(G) R145.1
ORIN_TX: IC12.13(2B1) R140.1
ORIN_TXD: CN3.99 R140.2
ORINOUT: CN3.128 R143.1
S32_GPI: R142.2 ; also sheet 4
S32_GPO: IC12.7(1A2) ; also sheet 4
SHUT_REQ: Q9.3(D) R147.2 ; also sheet 4
UART2_RXD: CN3.238 TP11.P$1
UART2_TXD: CN3.236 TP10.P$1
UART3_RX: R141.2 ; also sheet 4
UART3_TX: IC12.6(1A1) ; also sheet 4
USB0_D_N [90R]: CN3.109 ; also sheet 1
USB0_D_P [90R]: CN3.111 ; also sheet 1
USB_5V_EN: CN3.127 IC13.B2(ON) R150.1
USBSS0_RX_N [90R]: CN3.161 ; also sheet 1
USBSS0_RX_P [90R]: CN3.163 ; also sheet 1
USBSS0_TX_N [90R]: CN3.166 ; also sheet 1
USBSS0_TX_P [90R]: CN3.168 ; also sheet 1
VBUS: C267.2 C268.2 IC13.A1(VOUT) Q10.1(G) R149.1 ; also sheet 1
VBUS_DET: CN3.87 Q10.3(D)
Unconnected: CN3.3 CN3.4 CN3.5 CN3.6 CN3.9 CN3.10 CN3.11 CN3.12 CN3.15 CN3.16 CN3.17 CN3.18 CN3.21 CN3.22 CN3.23 CN3.24 CN3.27 CN3.28 CN3.29 CN3.30 CN3.33 CN3.34 CN3.35 CN3.36 CN3.39 CN3.40 CN3.41 CN3.42 CN3.45 CN3.46 CN3.47 CN3.48 CN3.51 CN3.52 CN3.53 CN3.54 CN3.57 CN3.58 CN3.59 CN3.60 CN3.63 CN3.64 CN3.65 CN3.66 CN3.69 CN3.70 CN3.71 CN3.72 CN3.75 CN3.76 CN3.77 CN3.78 CN3.81 CN3.82 CN3.83 CN3.84 CN3.88 CN3.89 CN3.90 CN3.91 CN3.92 CN3.93 CN3.94 CN3.95 CN3.96 CN3.97 CN3.98 CN3.100 CN3.103 CN3.104 CN3.105 CN3.106 CN3.108 CN3.110 CN3.112 CN3.114 CN3.115 CN3.116 CN3.117 CN3.118 CN3.120 CN3.121 CN3.122 CN3.123 CN3.124 CN3.126 CN3.131 CN3.133 CN3.134 CN3.136 CN3.137 CN3.139 CN3.140 CN3.142 CN3.148 CN3.149 CN3.150 CN3.151 CN3.154 CN3.155 CN3.156 CN3.157 CN3.160 CN3.162 CN3.167 CN3.169 CN3.172 CN3.173 CN3.174 CN3.175 CN3.178 CN3.179 CN3.180 CN3.181 CN3.182 CN3.183 CN3.185 CN3.187 CN3.188 CN3.189 CN3.191 CN3.193 CN3.194 CN3.195 CN3.197 CN3.199 CN3.203 CN3.205 CN3.206 CN3.207 CN3.208 CN3.209 CN3.210 CN3.211 CN3.212 CN3.213 CN3.214 CN3.215 CN3.216 CN3.218 CN3.219 CN3.220 CN3.221 CN3.222 CN3.223 CN3.224 CN3.225 CN3.226 CN3.227 CN3.228 CN3.229 CN3.230 CN3.232 CN3.234 CN3.235 CN3.240 CN3.S1(A:SHIELD) CN3.S2(A:SHIELD)

### Notes on the sheet
- NVIDIA Jetson Nano Orin
- UART Comms
  with S32
- 5V Signal
- Debug Uart
  Test Points
- Internal UART | ShutDown Request | USB 5V Power Supply
- H = ON
  L = OFF
- BASIC/design/LM.sch
- hw_LM/BASIC
- 1010xx
- jcc5
- abs8

## Sheet 6 of 9: Ethernet
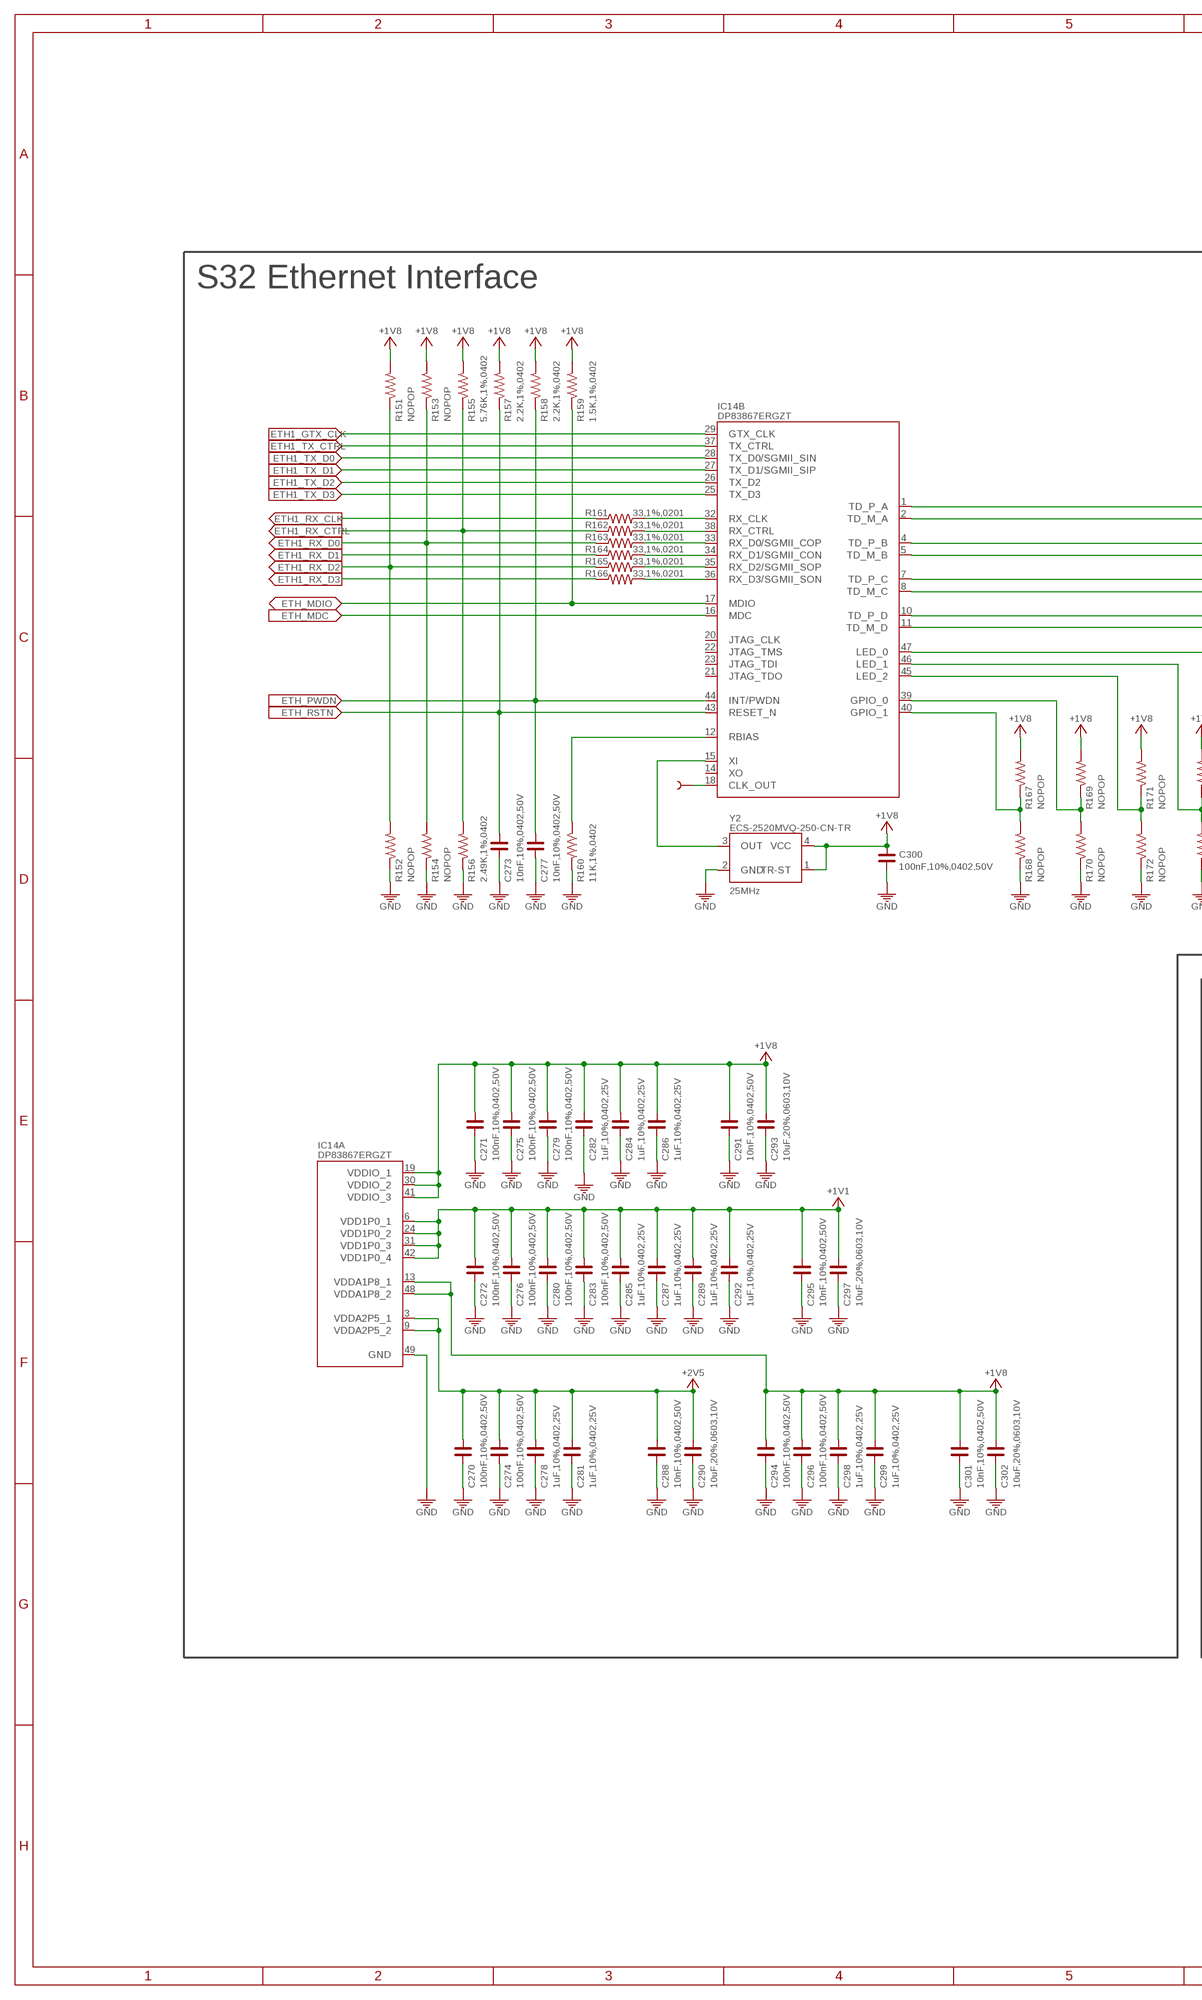
[diagram p8: schematic, sheet 6, part 1 of 2]
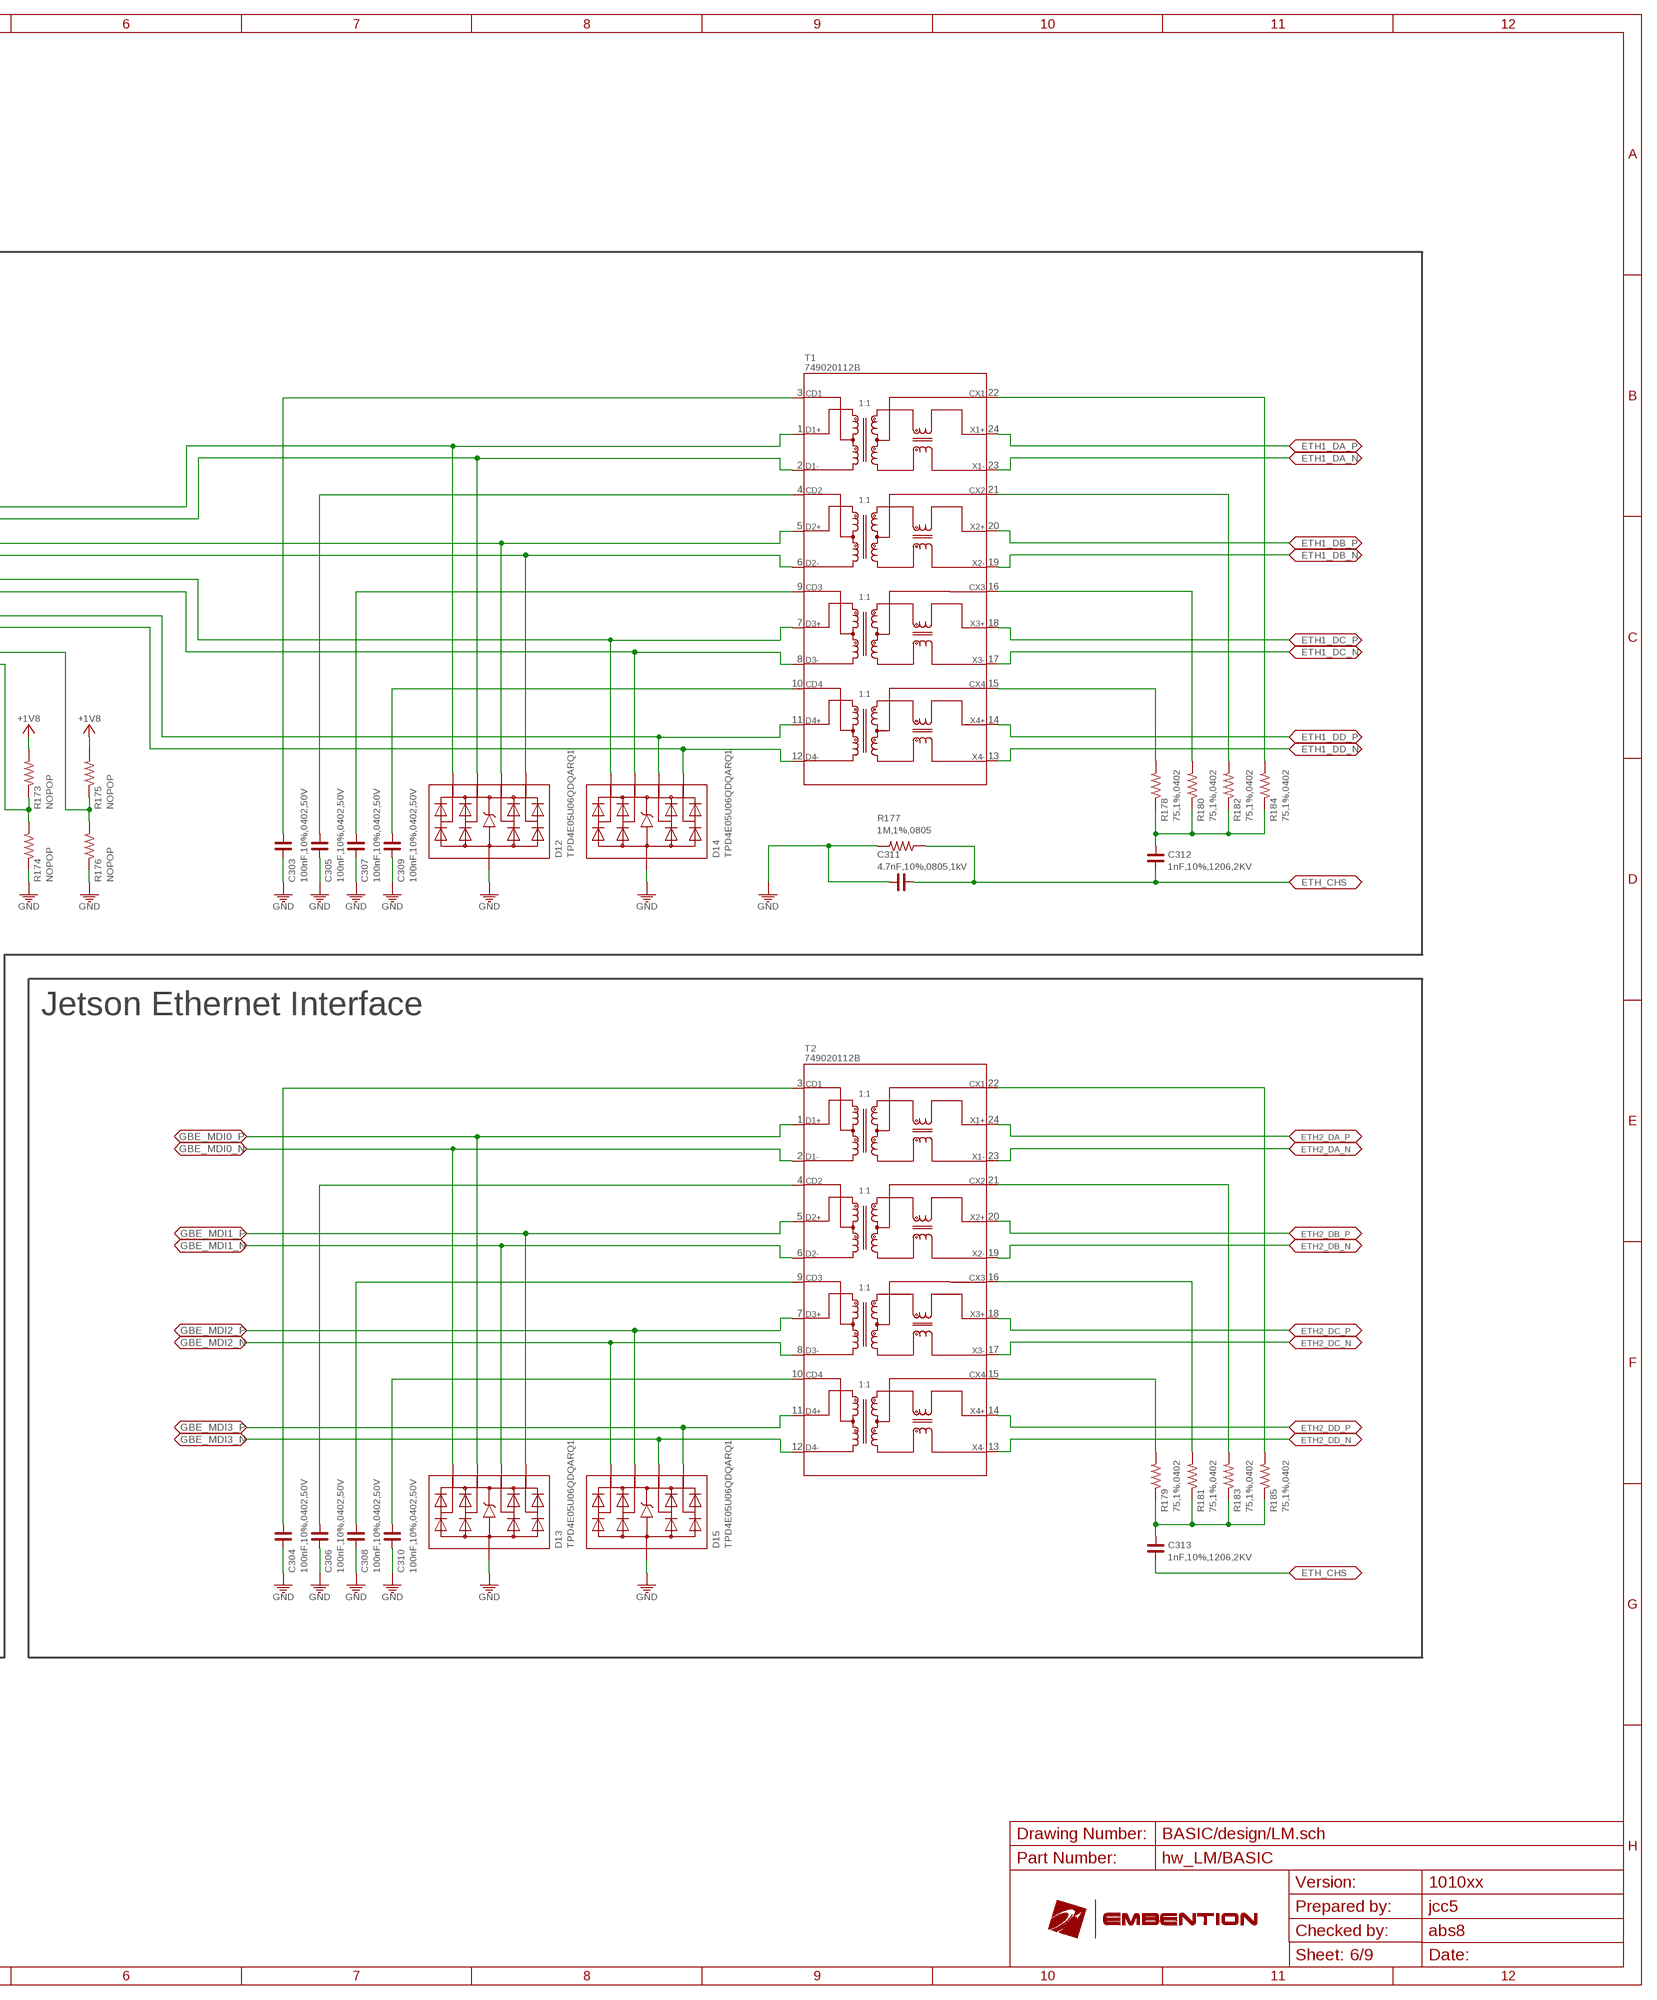
[diagram p9: schematic, sheet 6, part 2 of 2]

### Parts
C270  100nF,10%,0402,50V  C_0402  [C0402]
C271  100nF,10%,0402,50V  C_0402  [C0402]
C272  100nF,10%,0402,50V  C_0402  [C0402]
C273  10nF,10%,0402,50V  C_0402  [C0402]
C274  100nF,10%,0402,50V  C_0402  [C0402]
C275  100nF,10%,0402,50V  C_0402  [C0402]
C276  100nF,10%,0402,50V  C_0402  [C0402]
C277  10nF,10%,0402,50V  C_0402  [C0402]
C278  1uF,10%,0402,25V  C_0402  [C0402]
C279  100nF,10%,0402,50V  C_0402  [C0402]
C280  100nF,10%,0402,50V  C_0402  [C0402]
C281  1uF,10%,0402,25V  C_0402  [C0402]
C282  1uF,10%,0402,25V  C_0402  [C0402]
C283  100nF,10%,0402,50V  C_0402  [C0402]
C284  1uF,10%,0402,25V  C_0402  [C0402]
C285  1uF,10%,0402,25V  C_0402  [C0402]
C286  1uF,10%,0402,25V  C_0402  [C0402]
C287  1uF,10%,0402,25V  C_0402  [C0402]
C288  10nF,10%,0402,50V  C_0402  [C0402]
C289  1uF,10%,0402,25V  C_0402  [C0402]
C290  10uF,20%,0603,10V  C_0603  [C0603]
C291  10nF,10%,0402,50V  C_0402  [C0402]
C292  1uF,10%,0402,25V  C_0402  [C0402]
C293  10uF,20%,0603,10V  C_0603  [C0603]
C294  100nF,10%,0402,50V  C_0402  [C0402]
C295  10nF,10%,0402,50V  C_0402  [C0402]
C296  100nF,10%,0402,50V  C_0402  [C0402]
C297  10uF,20%,0603,10V  C_0603  [C0603]
C298  1uF,10%,0402,25V  C_0402  [C0402]
C299  1uF,10%,0402,25V  C_0402  [C0402]
C300  100nF,10%,0402,50V  C_0402  [C0402]
C301  10nF,10%,0402,50V  C_0402  [C0402]
C302  10uF,20%,0603,10V  C_0603  [C0603]
C303  100nF,10%,0402,50V  C_0402  [C0402]
C304  100nF,10%,0402,50V  C_0402  [C0402]
C305  100nF,10%,0402,50V  C_0402  [C0402]
C306  100nF,10%,0402,50V  C_0402  [C0402]
C307  100nF,10%,0402,50V  C_0402  [C0402]
C308  100nF,10%,0402,50V  C_0402  [C0402]
C309  100nF,10%,0402,50V  C_0402  [C0402]
C310  100nF,10%,0402,50V  C_0402  [C0402]
C311  4.7nF,10%,0805,1kV  C_0805  [C0805]
C312  1nF,10%,1206,2KV  C_1206  [C1206]
C313  1nF,10%,1206,2KV  C_1206  [C1206]
D12  TPD4E05U06QDQARQ1  [DQA(R-PUSON-N10)]
D13  TPD4E05U06QDQARQ1  [DQA(R-PUSON-N10)]
D14  TPD4E05U06QDQARQ1  [DQA(R-PUSON-N10)]
D15  TPD4E05U06QDQARQ1  [DQA(R-PUSON-N10)]
IC14  DP83867ERGZT  DP83867ERGZ  [VQFN-48]
R151  NOPOP  R_0402  [R0402]
R152  NOPOP  R_0402  [R0402]
R153  NOPOP  R_0402  [R0402]
R154  NOPOP  R_0402  [R0402]
R155  5.76K,1%,0402  R_0402  [R0402]
R156  2.49K,1%,0402  R_0402  [R0402]
R157  2.2K,1%,0402  R_0402  [R0402]
R158  2.2K,1%,0402  R_0402  [R0402]
R159  1.5K,1%,0402  R_0402  [R0402]
R160  11K,1%,0402  R_0402  [R0402]
R161  33,1%,0201  R_0201  [R0201]
R162  33,1%,0201  R_0201  [R0201]
R163  33,1%,0201  R_0201  [R0201]
R164  33,1%,0201  R_0201  [R0201]
R165  33,1%,0201  R_0201  [R0201]
R166  33,1%,0201  R_0201  [R0201]
R167  NOPOP  R_0402  [R0402]
R168  NOPOP  R_0402  [R0402]
R169  NOPOP  R_0402  [R0402]
R170  NOPOP  R_0402  [R0402]
R171  NOPOP  R_0402  [R0402]
R172  NOPOP  R_0402  [R0402]
R173  NOPOP  R_0402  [R0402]
R174  NOPOP  R_0402  [R0402]
R175  NOPOP  R_0402  [R0402]
R176  NOPOP  R_0402  [R0402]
R177  1M,1%,0805  R_0805  [R0805]
R178  75,1%,0402  R_0402  [R0402]
R179  75,1%,0402  R_0402  [R0402]
R180  75,1%,0402  R_0402  [R0402]
R181  75,1%,0402  R_0402  [R0402]
R182  75,1%,0402  R_0402  [R0402]
R183  75,1%,0402  R_0402  [R0402]
R184  75,1%,0402  R_0402  [R0402]
R185  75,1%,0402  R_0402  [R0402]
T1  749020112B  [749020112B]
T2  749020112B  [749020112B]
TP13  NOPOP  TEST-POINT2  [PAD.02X.02]
Y2  ECS-2520MVQ-250-CN-TR  [ECS-2520MVQ]

### Nets
+1V1: C272.1 C276.1 C280.1 C283.1 C285.1 C287.1 C289.1 C292.1 C295.1 C297.1 IC14.6(A:VDD1P0_1) IC14.24(A:VDD1P0_2) IC14.31(A:VDD1P0_3) IC14.42(A:VDD1P0_4) ; also sheet 2,3,4
+1V8: C271.1 C275.1 C279.1 C282.1 C284.1 C286.1 C291.1 C293.1 C294.1 C296.1 C298.1 C299.1 C300.1 C301.1 C302.1 IC14.13(A:VDDA1P8_1) IC14.19(A:VDDIO_1) IC14.30(A:VDDIO_2) IC14.41(A:VDDIO_3) IC14.48(A:VDDA1P8_2) R151.2 R153.2 R155.2 R157.2 R158.2 R159.2 R167.2 R169.2 R171.2 R173.2 R175.2 Y2.1(TR-ST) Y2.4(VCC) ; also sheet 2,3,4,5
+2V5: C270.1 C274.1 C278.1 C281.1 C288.1 C290.1 IC14.3(A:VDDA2P5_1) IC14.9(A:VDDA2P5_2) ; also sheet 2,4
ETH1_DA_N [100R]: T1.23(X1-) ; also sheet 1
ETH1_DA_P [100R]: T1.24(X1+) ; also sheet 1
ETH1_DB_N [100R]: T1.19(X2-) ; also sheet 1
ETH1_DB_P [100R]: T1.20(X2+) ; also sheet 1
ETH1_DC_N [100R]: T1.17(X3-) ; also sheet 1
ETH1_DC_P [100R]: T1.18(X3+) ; also sheet 1
ETH1_DD_N [100R]: T1.13(X4-) ; also sheet 1
ETH1_DD_P [100R]: T1.14(X4+) ; also sheet 1
ETH1_GTX_CLK [50R]: IC14.29(B:GTX_CLK) ; also sheet 4
ETH1_MCT_A: R184.2 T1.22(CX1)
ETH1_MCT_B: R182.2 T1.21(CX2)
ETH1_MCT_C: R180.2 T1.16(CX3)
ETH1_MCT_D: R178.2 T1.15(CX4)
ETH1_RX_CLK [50R]: R161.1 ; also sheet 4
ETH1_RX_CTRL [50R]: R155.1 R156.2 R162.1 ; also sheet 4
ETH1_RX_D0 [50R]: R153.1 R154.2 R163.1 ; also sheet 4
ETH1_RX_D1 [50R]: R164.1 ; also sheet 4
ETH1_RX_D2 [50R]: R151.1 R152.2 R165.1 ; also sheet 4
ETH1_RX_D3 [50R]: R166.1 ; also sheet 4
ETH1_TCT_A: C303.1 T1.3(CD1)
ETH1_TCT_B: C305.1 T1.4(CD2)
ETH1_TCT_C: C307.1 T1.9(CD3)
ETH1_TCT_D: C309.1 T1.10(CD4)
ETH1_TD_A_N [100R]: D12.2(K2) D12.9(K2) IC14.2(B:TD_M_A) T1.2(D1-)
ETH1_TD_A_P [100R]: D12.1(K1) D12.10(K1) IC14.1(B:TD_P_A) T1.1(D1+)
ETH1_TD_B_N [100R]: D12.5(K4) D12.6(K4) IC14.5(B:TD_M_B) T1.6(D2-)
ETH1_TD_B_P [100R]: D12.4(K3) D12.7(K3) IC14.4(B:TD_P_B) T1.5(D2+)
ETH1_TD_C_N [100R]: D14.2(K2) D14.9(K2) IC14.8(B:TD_M_C) T1.8(D3-)
ETH1_TD_C_P [100R]: D14.1(K1) D14.10(K1) IC14.7(B:TD_P_C) T1.7(D3+)
ETH1_TD_D_N [100R]: D14.5(K4) D14.6(K4) IC14.11(B:TD_M_D) T1.12(D4-)
ETH1_TD_D_P [100R]: D14.4(K3) D14.7(K3) IC14.10(B:TD_P_D) T1.11(D4+)
ETH1_TX_CTRL [50R]: IC14.37(B:TX_CTRL) ; also sheet 4
ETH1_TX_D0 [50R]: IC14.28(B:TX_D0/SGMII_SIN) ; also sheet 4
ETH1_TX_D1 [50R]: IC14.27(B:TX_D1/SGMII_SIP) ; also sheet 4
ETH1_TX_D2 [50R]: IC14.26(B:TX_D2) ; also sheet 4
ETH1_TX_D3 [50R]: IC14.25(B:TX_D3) ; also sheet 4
ETH2_DA_N [100R]: T2.23(X1-) ; also sheet 1
ETH2_DA_P [100R]: T2.24(X1+) ; also sheet 1
ETH2_DB_N [100R]: T2.19(X2-) ; also sheet 1
ETH2_DB_P [100R]: T2.20(X2+) ; also sheet 1
ETH2_DC_N [100R]: T2.17(X3-) ; also sheet 1
ETH2_DC_P [100R]: T2.18(X3+) ; also sheet 1
ETH2_DD_N [100R]: T2.13(X4-) ; also sheet 1
ETH2_DD_P [100R]: T2.14(X4+) ; also sheet 1
ETH2_MCT_A: R185.2 T2.22(CX1)
ETH2_MCT_B: R183.2 T2.21(CX2)
ETH2_MCT_C: R181.2 T2.16(CX3)
ETH2_MCT_D: R179.2 T2.15(CX4)
ETH2_TCT_A: C304.1 T2.3(CD1)
ETH2_TCT_B: C306.1 T2.4(CD2)
ETH2_TCT_C: C308.1 T2.9(CD3)
ETH2_TCT_D: C310.1 T2.10(CD4)
ETH_CHS: C311.1 C312.2 C313.2 R177.1 ; also sheet 1
ETH_CLK_OUT: IC14.18(B:CLK_OUT) TP13.P$1
ETH_GPIO0: IC14.39(B:GPIO_0) R169.1 R170.2
ETH_GPIO1: IC14.40(B:GPIO_1) R167.1 R168.2
ETH_LED0: IC14.47(B:LED_0) R175.1 R176.2
ETH_LED1: IC14.46(B:LED_1) R173.1 R174.2
ETH_LED2: IC14.45(B:LED_2) R171.1 R172.2
ETH_MDC: IC14.16(B:MDC) ; also sheet 4
ETH_MDIO: IC14.17(B:MDIO) R159.1 ; also sheet 4
ETH_PWDN: C277.1 IC14.44(B:INT/PWDN) R158.1 ; also sheet 4
ETH_RBIAS: IC14.12(B:RBIAS) R160.1
ETH_RSTN: C273.1 IC14.43(B:RESET_N) R157.1 ; also sheet 4
ETH_XI: IC14.15(B:XI) Y2.3(OUT)
GBE_MDI0_N [100R]: D13.1(K1) D13.10(K1) T2.2(D1-) ; also sheet 5
GBE_MDI0_P [100R]: D13.2(K2) D13.9(K2) T2.1(D1+) ; also sheet 5
GBE_MDI1_N [100R]: D13.4(K3) D13.7(K3) T2.6(D2-) ; also sheet 5
GBE_MDI1_P [100R]: D13.5(K4) D13.6(K4) T2.5(D2+) ; also sheet 5
GBE_MDI2_N [100R]: D15.1(K1) D15.10(K1) T2.8(D3-) ; also sheet 5
GBE_MDI2_P [100R]: D15.2(K2) D15.9(K2) T2.7(D3+) ; also sheet 5
GBE_MDI3_N [100R]: D15.4(K3) D15.7(K3) T2.12(D4-) ; also sheet 5
GBE_MDI3_P [100R]: D15.5(K4) D15.6(K4) T2.11(D4+) ; also sheet 5
GND: C270.2 C271.2 C272.2 C273.2 C274.2 C275.2 C276.2 C277.2 C278.2 C279.2 C280.2 C281.2 C282.2 C283.2 C284.2 C285.2 C286.2 C287.2 C288.2 C289.2 C290.2 C291.2 C292.2 C293.2 C294.2 C295.2 C296.2 C297.2 C298.2 C299.2 C300.2 C301.2 C302.2 C303.2 C304.2 C305.2 C306.2 C307.2 C308.2 C309.2 C310.2 C311.2 D12.3(CA) D12.8(CA) D13.3(CA) D13.8(CA) D14.3(CA) D14.8(CA) D15.3(CA) D15.8(CA) IC14.49(A:GND) R152.1 R154.1 R156.1 R160.2 R168.1 R170.1 R172.1 R174.1 R176.1 R177.2 Y2.2(GND) ; also sheet 1,2,3,4,5,7,8,9
N$15: C312.1 R178.1 R180.1 R182.1 R184.1
N$19: C313.1 R179.1 R181.1 R183.1 R185.1
RX_CLK [50R]: IC14.32(B:RX_CLK) R161.2
RX_CTRL [50R]: IC14.38(B:RX_CTRL) R162.2
RX_D0 [50R]: IC14.33(B:RX_D0/SGMII_COP) R163.2
RX_D1 [50R]: IC14.34(B:RX_D1/SGMII_CON) R164.2
RX_D2 [50R]: IC14.35(B:RX_D2/SGMII_SOP) R165.2
RX_D3 [50R]: IC14.36(B:RX_D3/SGMII_SON) R166.2
Unconnected: IC14.14(B:XO) IC14.20(B:JTAG_CLK) IC14.21(B:JTAG_TDO) IC14.22(B:JTAG_TMS) IC14.23(B:JTAG_TDI)

### Notes on the sheet
- S32 Ethernet Interface
- 25MHz
- Jetson Ethernet Interface
- BASIC/design/LM.sch
- hw_LM/BASIC
- 1010xx
- jcc5
- abs8

## Sheet 7 of 9: CAN Interface
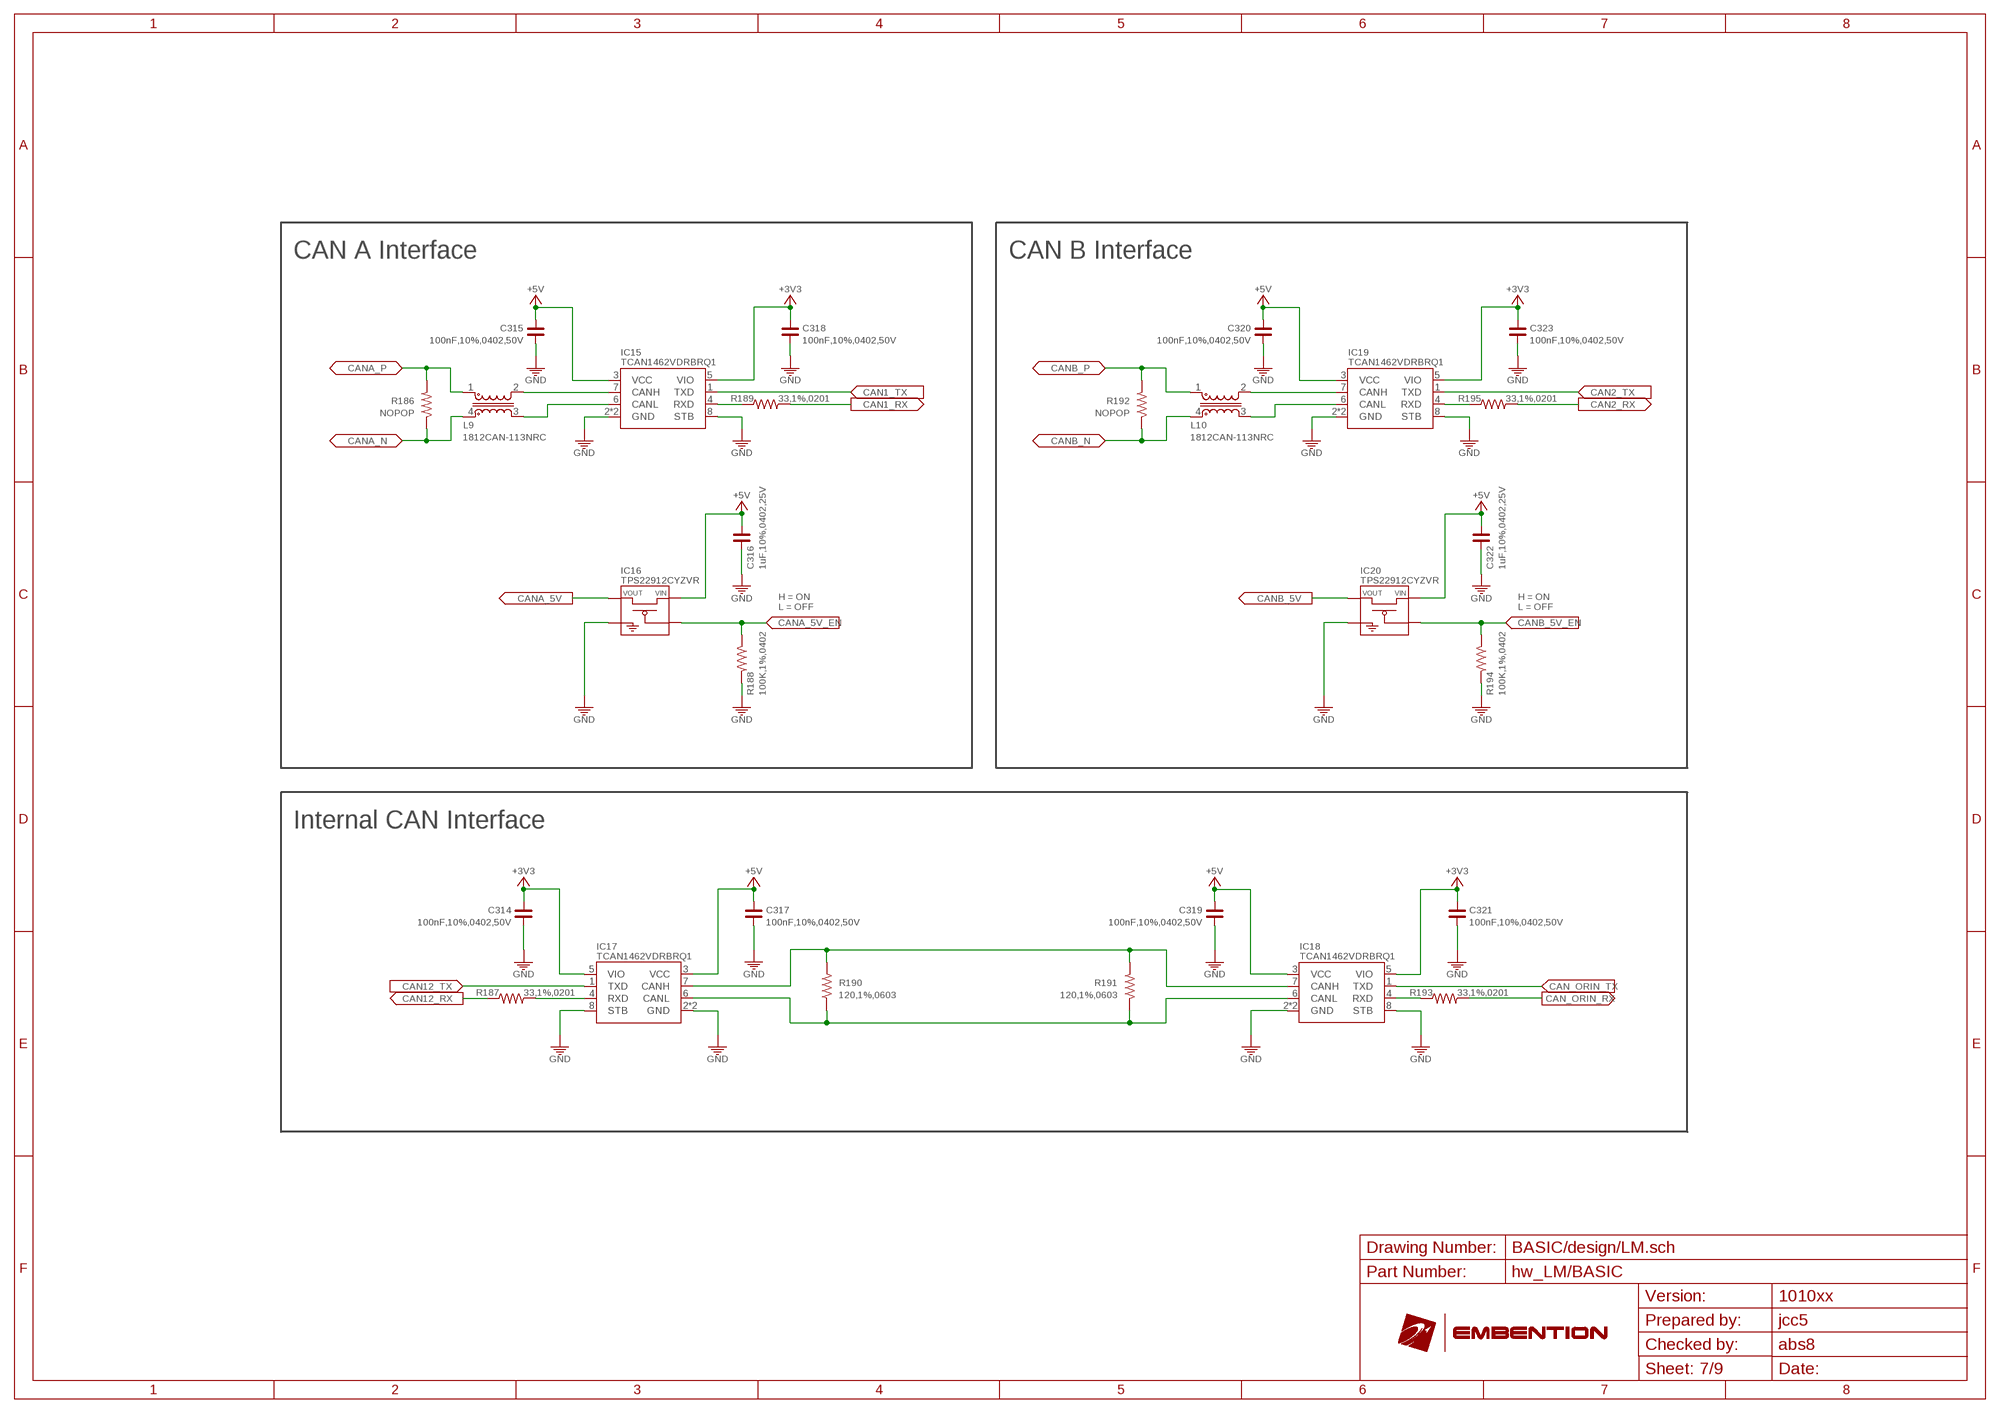
[diagram p10: schematic, sheet 7]

### Parts
C314  100nF,10%,0402,50V  C_0402  [C0402]
C315  100nF,10%,0402,50V  C_0402  [C0402]
C316  1uF,10%,0402,25V  C_0402  [C0402]
C317  100nF,10%,0402,50V  C_0402  [C0402]
C318  100nF,10%,0402,50V  C_0402  [C0402]
C319  100nF,10%,0402,50V  C_0402  [C0402]
C320  100nF,10%,0402,50V  C_0402  [C0402]
C321  100nF,10%,0402,50V  C_0402  [C0402]
C322  1uF,10%,0402,25V  C_0402  [C0402]
C323  100nF,10%,0402,50V  C_0402  [C0402]
IC15  TCAN1462VDRBRQ1  TCAN1462V-Q1VSON-8  [VSON-8]
IC16  TPS22912CYZVR  TPS2291XX  [DSBGA-4_YZV]
IC17  TCAN1462VDRBRQ1  TCAN1462V-Q1VSON-8  [VSON-8]
IC18  TCAN1462VDRBRQ1  TCAN1462V-Q1VSON-8  [VSON-8]
IC19  TCAN1462VDRBRQ1  TCAN1462V-Q1VSON-8  [VSON-8]
IC20  TPS22912CYZVR  TPS2291XX  [DSBGA-4_YZV]
L9  1812CAN-113NRC  1812CAN  [1812CAN]
L10  1812CAN-113NRC  1812CAN  [1812CAN]
R186  NOPOP  R_0603  [R0603]
R187  33,1%,0201  R_0201  [R0201]
R188  100K,1%,0402  R_0402  [R0402]
R189  33,1%,0201  R_0201  [R0201]
R190  120,1%,0603  R_0603  [R0603]
R191  120,1%,0603  R_0603  [R0603]
R192  NOPOP  R_0603  [R0603]
R193  33,1%,0201  R_0201  [R0201]
R194  100K,1%,0402  R_0402  [R0402]
R195  33,1%,0201  R_0201  [R0201]

### Nets
+3V3: C314.2 C318.2 C321.2 C323.2 IC15.5(VIO) IC17.5(VIO) IC18.5(VIO) IC19.5(VIO) ; also sheet 2,3,4,5,8,9
+5V: C315.2 C316.1 C317.2 C319.2 C320.2 C322.1 IC15.3(VCC) IC16.A2(VIN) IC17.3(VCC) IC18.3(VCC) IC19.3(VCC) IC20.A2(VIN) ; also sheet 2,4,5,8
CAN1_N [120R]: IC15.6(CANL) L9.3
CAN1_P [120R]: IC15.7(CANH) L9.2
CAN1_RX: R189.2 ; also sheet 4
CAN1_TX: IC15.1(TXD) ; also sheet 4
CAN2_N [120R]: IC19.6(CANL) L10.3
CAN2_P [120R]: IC19.7(CANH) L10.2
CAN2_RX: R195.2 ; also sheet 4
CAN2_TX: IC19.1(TXD) ; also sheet 4
CAN12_RX: R187.1 ; also sheet 4
CAN12_TX: IC17.1(TXD) ; also sheet 4
CAN_INT_N [120R]: IC17.6(CANL) IC18.6(CANL) R190.1 R191.1
CAN_INT_P [120R]: IC17.7(CANH) IC18.7(CANH) R190.2 R191.2
CAN_ORIN_RX: R193.2 ; also sheet 5
CAN_ORIN_TX: IC18.1(TXD) ; also sheet 5
CANA_5V: IC16.A1(VOUT) ; also sheet 1
CANA_5V_EN: IC16.B2(ON) R188.1 ; also sheet 4
CANA_N [120R]: L9.4 R186.1 ; also sheet 1
CANA_P [120R]: L9.1 R186.2 ; also sheet 1
CANB_5V: IC20.A1(VOUT) ; also sheet 1
CANB_5V_EN: IC20.B2(ON) R194.1 ; also sheet 4
CANB_N [120R]: L10.4 R192.1 ; also sheet 1
CANB_P [120R]: L10.1 R192.2 ; also sheet 1
GND: C314.1 C315.1 C316.2 C317.1 C318.1 C319.1 C320.1 C321.1 C322.2 C323.1 IC15.2(GND) IC15.8(STB) IC15.9(GND) IC16.B1(GND) IC17.2(GND) IC17.8(STB) IC17.9(GND) IC18.2(GND) IC18.8(STB) IC18.9(GND) IC19.2(GND) IC19.8(STB) IC19.9(GND) IC20.B1(GND) R188.2 R194.2 ; also sheet 1,2,3,4,5,6,8,9
N$56: IC18.4(RXD) R193.1
N$72: IC17.4(RXD) R187.2
N$125: IC15.4(RXD) R189.1
N$130: IC19.4(RXD) R195.1

### Notes on the sheet
- CAN A Interface | CAN B Interface
- H = ON
  L = OFF
- H = ON
  L = OFF
- Internal CAN Interface
- BASIC/design/LM.sch
- hw_LM/BASIC
- 1010xx
- jcc5
- abs8

## Sheet 8 of 9: LTE/GNSS
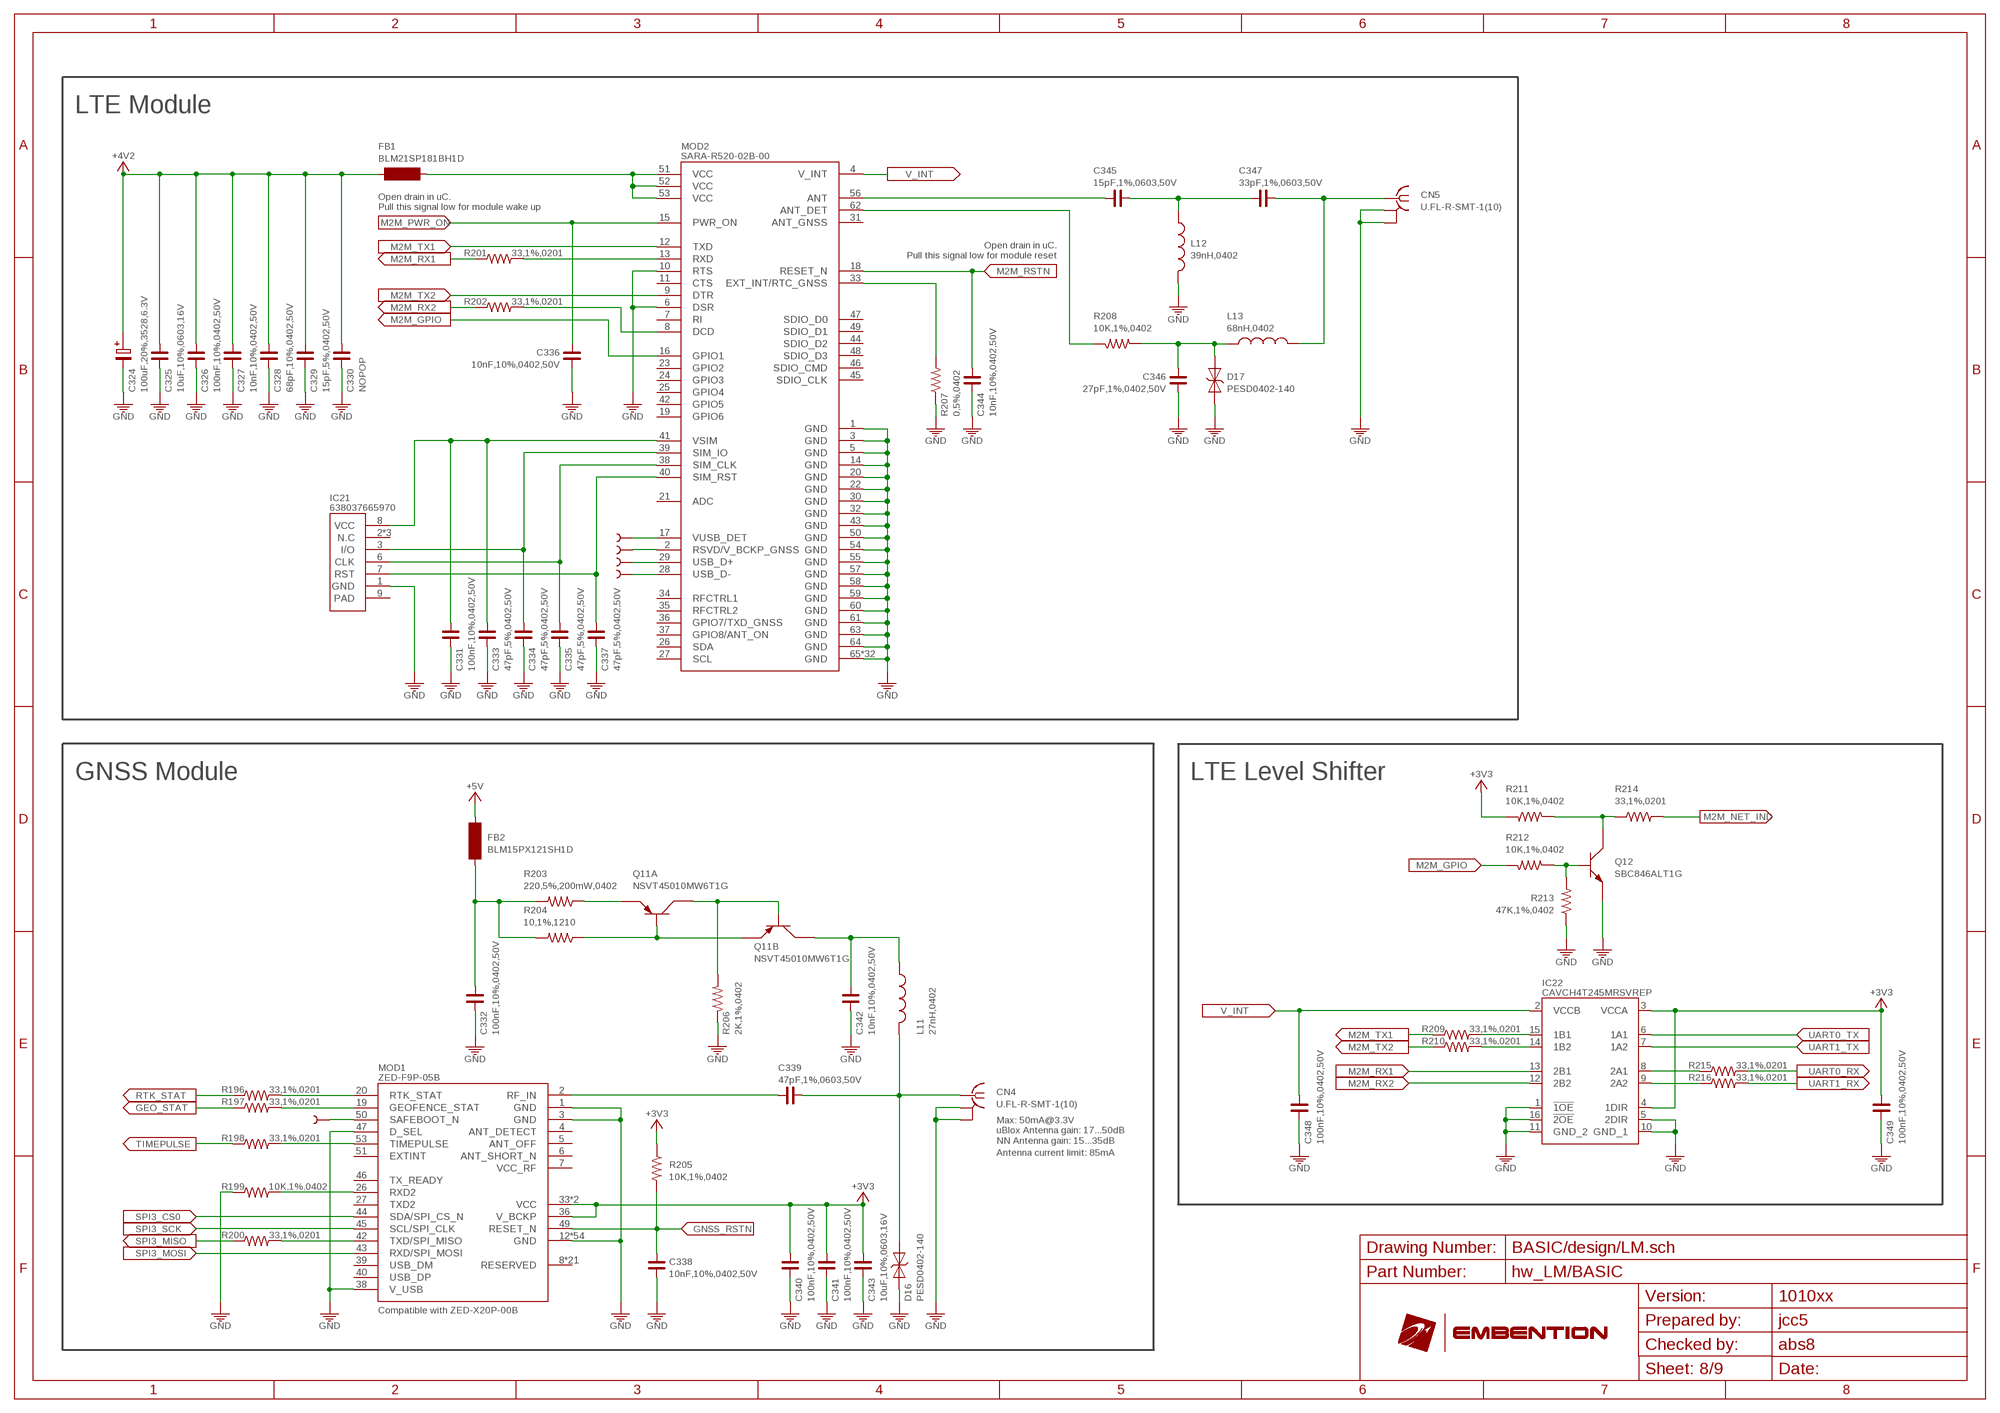
[diagram p11: schematic, sheet 8]

### Parts
C324  100uF,20%,3528,6.3V  C-PR-SMD-TE-B  [TE-B-3528]
C325  10uF,10%,0603,16V  C_0603  [C0603]
C326  100nF,10%,0402,50V  C_0402  [C0402]
C327  10nF,10%,0402,50V  C_0402  [C0402]
C328  68pF,10%,0402,50V  C_0402  [C0402]
C329  15pF,5%,0402,50V  C_0402  [C0402]
C330  NOPOP  C_0402  [C0402]
C331  100nF,10%,0402,50V  C_0402  [C0402]
C332  100nF,10%,0402,50V  C_0402  [C0402]
C333  47pF,5%,0402,50V  C_0402  [C0402]
C334  47pF,5%,0402,50V  C_0402  [C0402]
C335  47pF,5%,0402,50V  C_0402  [C0402]
C336  10nF,10%,0402,50V  C_0402  [C0402]
C337  47pF,5%,0402,50V  C_0402  [C0402]
C338  10nF,10%,0402,50V  C_0402  [C0402]
C339  47pF,1%,0603,50V  C_0603  [C0603]
C340  100nF,10%,0402,50V  C_0402  [C0402]
C341  100nF,10%,0402,50V  C_0402  [C0402]
C342  10nF,10%,0402,50V  C_0402  [C0402]
C343  10uF,10%,0603,16V  C_0603  [C0603]
C344  10nF,10%,0402,50V  C_0402  [C0402]
C345  15pF,1%,0603,50V  C_0603  [C0603]
C346  27pF,1%,0402,50V  C_0402  [C0402]
C347  33pF,1%,0603,50V  C_0603  [C0603]
C348  100nF,10%,0402,50V  C_0402  [C0402]
C349  100nF,10%,0402,50V  C_0402  [C0402]
CN4  U.FL-R-SMT-1(10)  U.FL-R-SMT-1  [U.FL-R-SMT-1]
CN5  U.FL-R-SMT-1(10)  U.FL-R-SMT-1  [U.FL-R-SMT-1]
D16  PESD0402-140  [PESD0402-140]
D17  PESD0402-140  [PESD0402-140]
FB1  BLM21SP181BH1D  BLM21PG300SN1D  [L0805]
FB2  BLM15PX121SH1D  [L0402]
IC21  638037665970  ESIM  [MFF2]
IC22  CAVCH4T245MRSVREP  SN74AVCH4T245-EP  [UQFN-16]
L11  27nH,0402  L_0402  [L0402]
L12  39nH,0402  L_0402  [L0402]
L13  68nH,0402  L_0402  [L0402]
MOD1  ZED-F9P-05B  ZED-F9P  [ZED-F9P]
MOD2  SARA-R520-02B-00  SARA-R52  [SARA]
Q11  NSVT45010MW6T1G  [SOT363]
Q12  SBC846ALT1G  [SOT23-3]
R196  33,1%,0201  R_0201  [R0201]
R197  33,1%,0201  R_0201  [R0201]
R198  33,1%,0201  R_0201  [R0201]
R199  10K,1%,0402  R_0402  [R0402]
R200  33,1%,0201  R_0201  [R0201]
R201  33,1%,0201  R_0201  [R0201]
R202  33,1%,0201  R_0201  [R0201]
R203  220,5%,200mW,0402  R_0402  [R0402]
R204  10,1%,1210  R_1210  [R1210]
R205  10K,1%,0402  R_0402  [R0402]
R206  2K,1%,0402  R_0402  [R0402]
R207  0,5%,0402  R_0402  [R0402]
R208  10K,1%,0402  R_0402  [R0402]
R209  33,1%,0201  R_0201  [R0201]
R210  33,1%,0201  R_0201  [R0201]
R211  10K,1%,0402  R_0402  [R0402]
R212  10K,1%,0402  R_0402  [R0402]
R213  47K,1%,0402  R_0402  [R0402]
R214  33,1%,0201  R_0201  [R0201]
R215  33,1%,0201  R_0201  [R0201]
R216  33,1%,0201  R_0201  [R0201]
TP14  NOPOP  TEST-POINT2  [PAD.02X.02]
TP15  NOPOP  TEST-POINT2  [PAD.02X.02]
TP16  NOPOP  TEST-POINT2  [PAD.02X.02]
TP17  NOPOP  TEST-POINT2  [PAD.02X.02]
TP18  NOPOP  TEST-POINT2  [PAD.02X.02]

### Nets
+3V3: C340.2 C341.2 C343.2 C349.2 IC22.3(VCCA) IC22.4(1DIR) MOD1.33(VCC) MOD1.34(VCC) MOD1.36(V_BCKP) R205.1 R211.1 ; also sheet 2,3,4,5,7,9
+4V2: C324.+ C325.2 C326.2 C327.2 C328.2 C329.2 C330.2 FB1.1 ; also sheet 2,4
+5V: FB2.1 ; also sheet 2,4,5,7
ANT_DC [50R_RF]: C345.2 C347.1 L12.1
ANT_DET_SARA: MOD2.62(ANT_DET) R208.2
ANT_OUT [50R_RF]: C345.1 MOD2.56(ANT)
GEO_STAT: R197.1 ; also sheet 4
GND: C324.- C325.1 C326.1 C327.1 C328.1 C329.1 C330.1 C331.2 C332.1 C333.2 C334.2 C335.2 C336.2 C337.2 C338.2 C340.1 C341.1 C342.1 C343.1 C344.2 C346.2 C348.1 C349.1 CN4.GND1(GNDGPS) CN4.GND2(GNDGPS1) CN5.GND1(GNDGPS) CN5.GND2(GNDGPS1) D16.P$1 D17.P$1 IC21.1(GND) IC22.1(!1OE) IC22.5(2DIR) IC22.10(GND_1) IC22.11(GND_2) IC22.16(!2OE) L12.2 MOD1.1(GND) MOD1.3(GND) MOD1.12(GND) MOD1.14(GND) MOD1.32(GND) MOD1.37(GND) MOD1.38(V_USB) MOD1.41(GND) MOD1.47(D_SEL) MOD1.48(GND) MOD1.GND1(GND) MOD1.GND2(GND) MOD1.GND3(GND) MOD1.GND4(GND) MOD1.GND5(GND) MOD1.GND6(GND) MOD1.GND7(GND) MOD1.GND8(GND) MOD1.GND9(GND) MOD1.GND10(GND) MOD1.GND11(GND) MOD1.GND12(GND) MOD1.GND13(GND) MOD1.GND14(GND) MOD1.GND15(GND) MOD1.GND16(GND) MOD1.GND17(GND) MOD1.GND18(GND) MOD1.GND19(GND) MOD1.GND20(GND) MOD1.GND21(GND) MOD1.GND22(GND) MOD1.GND23(GND) MOD1.GND24(GND) MOD1.GND25(GND) MOD1.GND26(GND) MOD1.GND27(GND) MOD1.GND28(GND) MOD1.GND29(GND) MOD1.GND30(GND) MOD1.GND31(GND) MOD1.GND32(GND) MOD1.GND33(GND) MOD1.GND34(GND) MOD1.GND35(GND) MOD1.GND36(GND) MOD1.GND37(GND) MOD1.GND38(GND) MOD1.GND39(GND) MOD1.GND40(GND) MOD1.GND41(GND) MOD1.GND42(GND) MOD1.GND43(GND) MOD1.GND44(GND) MOD1.GND45(GND) MOD1.GND46(GND) MOD1.GND47(GND) MOD1.GND48(GND) MOD2.1(GND) MOD2.3(GND) MOD2.5(GND) MOD2.6(DSR) MOD2.10(RTS) MOD2.14(GND) MOD2.20(GND) MOD2.22(GND) MOD2.30(GND) MOD2.32(GND) MOD2.43(GND) MOD2.50(GND) MOD2.54(GND) MOD2.55(GND) MOD2.57(GND) MOD2.58(GND) MOD2.59(GND) MOD2.60(GND) MOD2.61(GND) MOD2.63(GND) MOD2.64(GND) MOD2.65(GND) MOD2.66(GND) MOD2.67(GND) MOD2.68(GND) MOD2.69(GND) MOD2.70(GND) MOD2.71(GND) MOD2.72(GND) MOD2.73(GND) MOD2.74(GND) MOD2.75(GND) MOD2.76(GND) MOD2.77(GND) MOD2.78(GND) MOD2.79(GND) MOD2.80(GND) MOD2.81(GND) MOD2.82(GND) MOD2.83(GND) MOD2.84(GND) MOD2.85(GND) MOD2.86(GND) MOD2.87(GND) MOD2.88(GND) MOD2.89(GND) MOD2.90(GND) MOD2.91(GND) MOD2.92(GND) MOD2.93(GND) MOD2.94(GND) MOD2.95(GND) MOD2.96(GND) Q12.2(E) R199.1 R206.1 R207.1 R213.1 ; also sheet 1,2,3,4,5,6,7,9
GNSS [50R_RF]: C339.2 CN4.SIG D16.P$2 L11.2
GNSS_RSTN: C338.1 MOD1.49(RESET_N) R205.2 ; also sheet 4
LTE [50R_RF]: C347.2 CN5.SIG L13.2
M2M_DCD: MOD2.8(DCD) R202.2
M2M_GPIO: MOD2.16(GPIO1) R212.2
M2M_NET_IND: R214.2 ; also sheet 4
M2M_PWR_ON: C336.1 MOD2.15(PWR_ON) ; also sheet 4
M2M_RSTN: C344.1 MOD2.18(RESET_N) ; also sheet 4
M2M_RSVD: MOD2.2(RSVD/V_BCKP_GNSS) TP16.P$1
M2M_RX1: IC22.13(2B1) R201.1
M2M_RX2: IC22.12(2B2) R202.1
M2M_RXD: MOD2.13(RXD) R201.2
M2M_TX1: MOD2.12(TXD) R209.1
M2M_TX2: MOD2.9(DTR) R210.1
M2M_USB_D_N: MOD2.28(USB_D-) TP18.P$1
M2M_USB_D_P: MOD2.29(USB_D+) TP17.P$1
M2M_VBUS_DET: MOD2.17(VUSB_DET) TP15.P$1
M2M_VCC: FB1.2 MOD2.51(VCC) MOD2.52(VCC) MOD2.53(VCC)
N$2: Q12.3(C) R211.2 R214.1
N$6: Q11.5(B:B) Q11.6(A:C) R206.2
N$7: Q11.1(A:E) R203.1
N$12: MOD1.26(RXD2) R199.2
N$16: Q11.2(A:B) Q11.4(B:E) R204.1
N$20: Q12.1(B) R212.1 R213.2
N$38: IC22.14(1B2) R210.2
N$39: IC22.15(1B1) R209.2
N$42: IC22.9(2A2) R216.1
N$52: IC22.8(2A1) R215.1
N$93: MOD1.20(RTK_STAT) R196.2
N$94: MOD1.19(GEOFENCE_STAT) R197.2
N$118: C332.2 FB2.2 R203.2 R204.2
N$122: C342.2 L11.1 Q11.3(B:C)
N$129: MOD1.53(TIMEPULSE) R198.2
N$144: MOD1.42(TXD/SPI_MISO) R200.2
N$154: C346.1 D17.P$2 L13.1 R208.1
N$238: MOD2.33(EXT_INT/RTC_GNSS) R207.2
RF_IN [50R_RF]: C339.1 MOD1.2(RF_IN)
RTK_STAT: R196.1 ; also sheet 4
SAFEBOOT_N: MOD1.50(SAFEBOOT_N) TP14.P$1
SIM_CLK: C335.1 IC21.6(CLK) MOD2.38(SIM_CLK)
SIM_IO: C334.1 IC21.3(I/O) MOD2.39(SIM_IO)
SIM_RST: C337.1 IC21.7(RST) MOD2.40(SIM_RST)
SPI3_CS0: MOD1.44(SDA/SPI_CS_N) ; also sheet 4
SPI3_MISO: R200.1 ; also sheet 4
SPI3_MOSI: MOD1.43(RXD/SPI_MOSI) ; also sheet 4
SPI3_SCK: MOD1.45(SCL/SPI_CLK) ; also sheet 4
TIMEPULSE: R198.1 ; also sheet 4
UART0_RX: R215.2 ; also sheet 4
UART0_TX: IC22.6(1A1) ; also sheet 4
UART1_RX: R216.2 ; also sheet 4
UART1_TX: IC22.7(1A2) ; also sheet 4
V_INT: C348.2 IC22.2(VCCB) MOD2.4(V_INT)
VSIM: C331.1 C333.1 IC21.8(VCC) MOD2.41(VSIM)
Unconnected: IC21.2(N.C) IC21.4(N.C) IC21.5(N.C) IC21.9(PAD) MOD1.4(ANT_DETECT) MOD1.5(ANT_OFF) MOD1.6(ANT_SHORT_N) MOD1.7(VCC_RF) MOD1.8(RESERVED) MOD1.9(RESERVED) MOD1.10(RESERVED) MOD1.11(RESERVED) MOD1.13(RESERVED) MOD1.15(RESERVED) MOD1.16(RESERVED) MOD1.17(RESERVED) MOD1.18(RESERVED) MOD1.21(RESERVED) MOD1.22(RESERVED) MOD1.23(RESERVED) MOD1.24(RESERVED) MOD1.25(RESERVED) MOD1.27(TXD2) MOD1.28(RESERVED) MOD1.29(RESERVED) MOD1.30(RESERVED) MOD1.31(RESERVED) MOD1.35(RESERVED) MOD1.39(USB_DM) MOD1.40(USB_DP) MOD1.46(TX_READY) MOD1.51(EXTINT) MOD1.52(RESERVED) MOD1.54(RESERVED) MOD2.7(RI) MOD2.11(CTS) MOD2.19(GPIO6) MOD2.21(ADC) MOD2.23(GPIO2) MOD2.24(GPIO3) MOD2.25(GPIO4) MOD2.26(SDA) MOD2.27(SCL) MOD2.31(ANT_GNSS) MOD2.34(RFCTRL1) MOD2.35(RFCTRL2) MOD2.36(GPIO7/TXD_GNSS) MOD2.37(GPIO8/ANT_ON) MOD2.42(GPIO5) MOD2.44(SDIO_D2) MOD2.45(SDIO_CLK) MOD2.46(SDIO_CMD) MOD2.47(SDIO_D0) MOD2.48(SDIO_D3) MOD2.49(SDIO_D1)

### Notes on the sheet
- LTE Module
- Open drain in uC.
  Pull this signal low for module wake up
- Open drain in uC.
  Pull this signal low for module reset
- GNSS Module | LTE Level Shifter
- Max: 50mA@3.3V
  uBlox Antenna gain: 17...50dB
  NN Antenna gain: 15...35dB
- Antenna current limit: 85mA
- BASIC/design/LM.sch
- hw_LM/BASIC
- 1010xx
- Compatible with ZED-X20P-00B
- jcc5
- abs8

## Sheet 9 of 9: Sensors
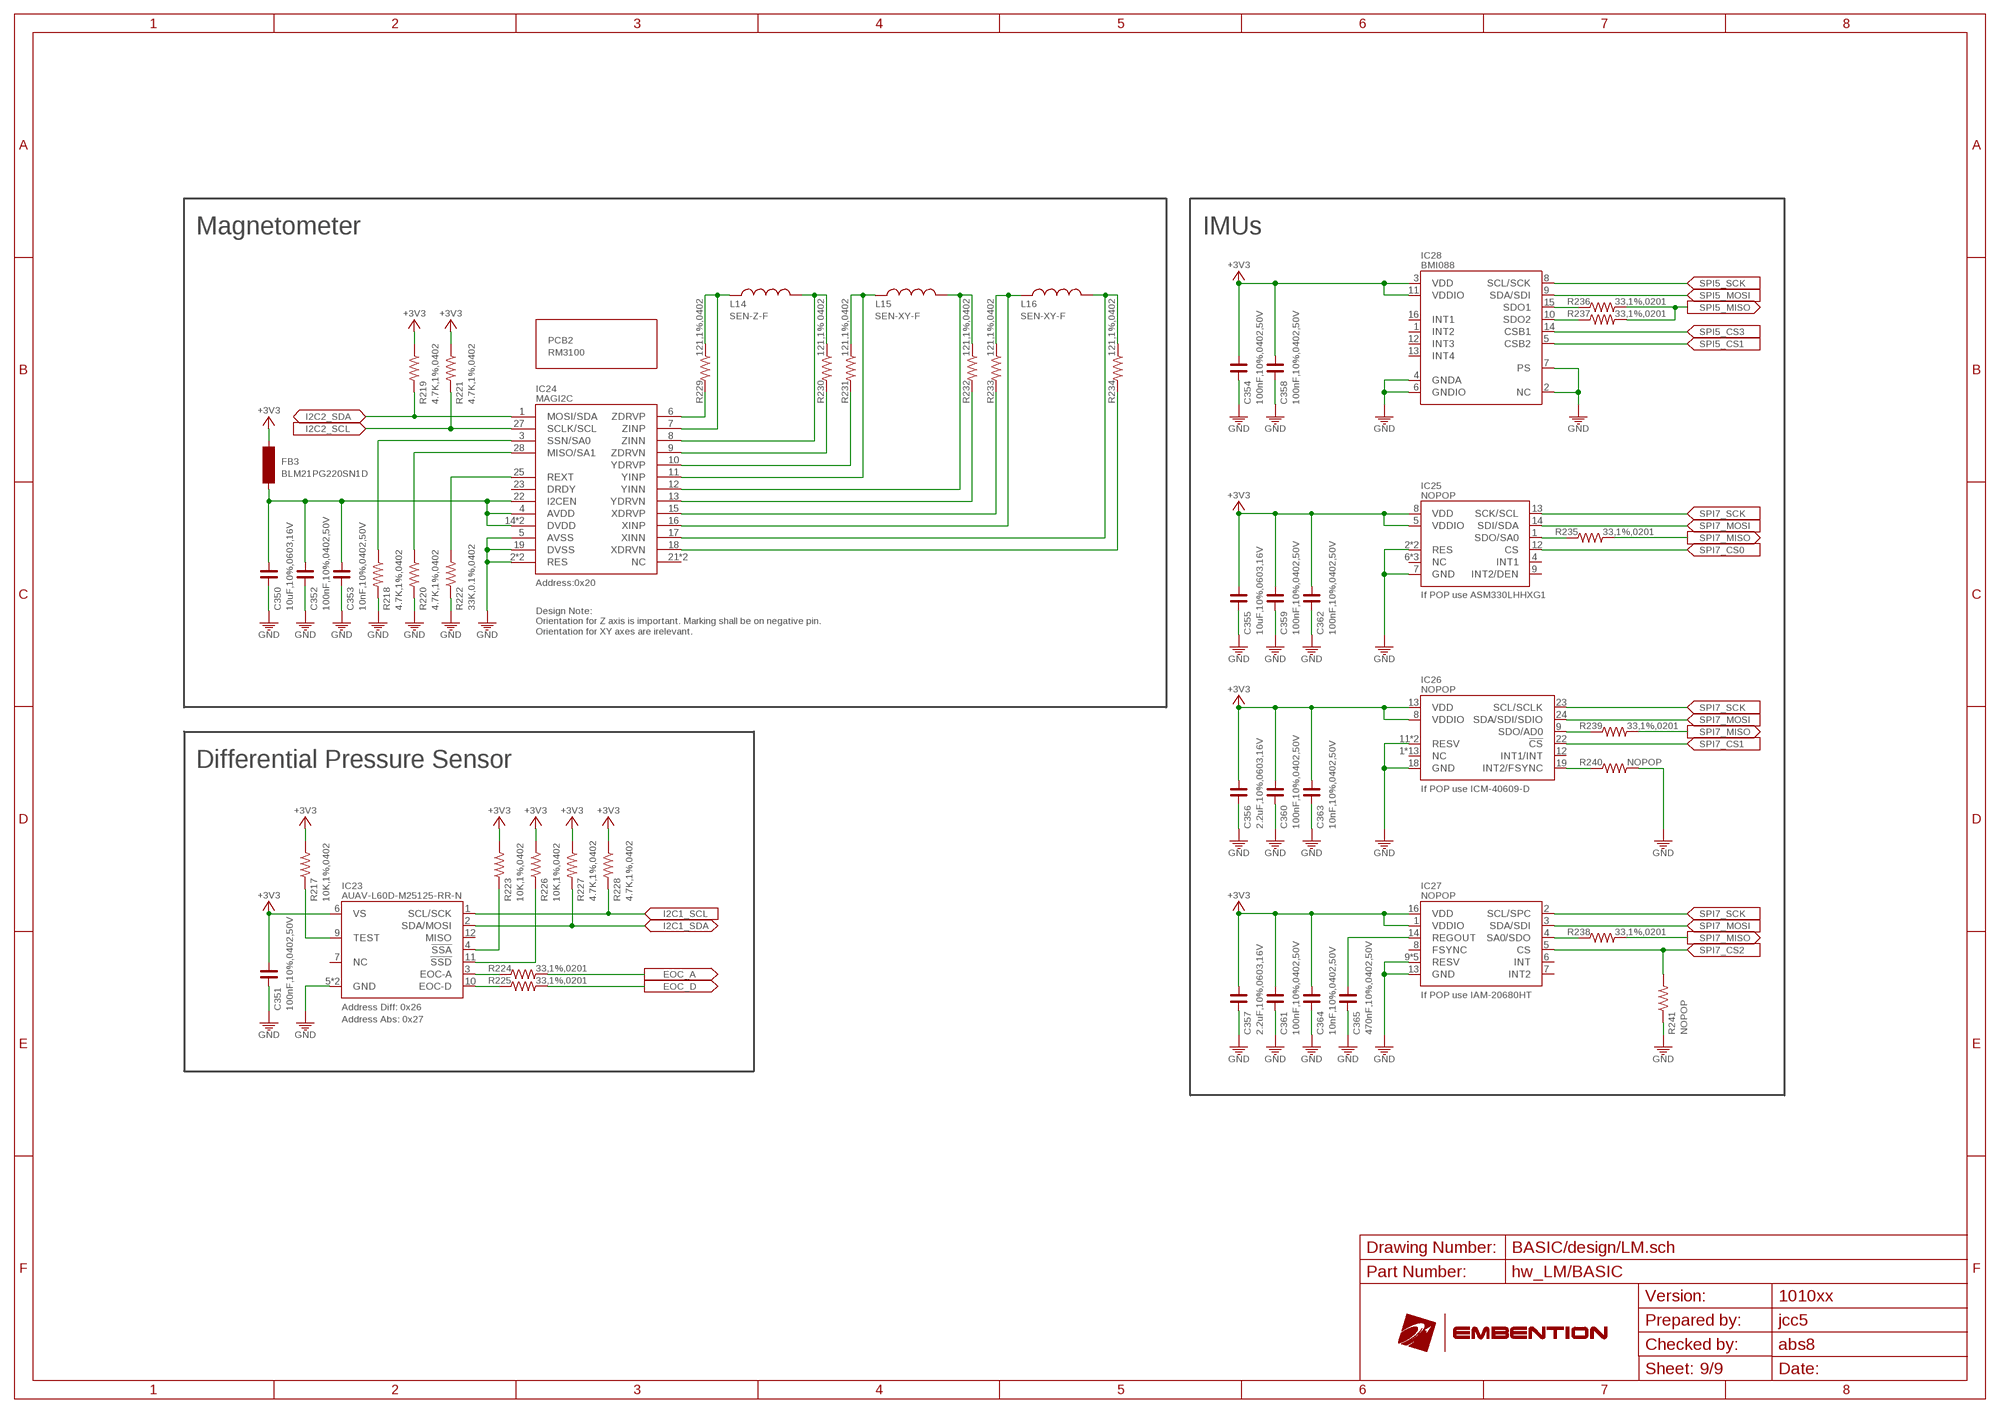
[diagram p12: schematic, sheet 9]

### Parts
C350  10uF,10%,0603,16V  C_0603  [C0603]
C351  100nF,10%,0402,50V  C_0402  [C0402]
C352  100nF,10%,0402,50V  C_0402  [C0402]
C353  10nF,10%,0402,50V  C_0402  [C0402]
C354  100nF,10%,0402,50V  C_0402  [C0402]
C355  10uF,10%,0603,16V  C_0603  [C0603]
C356  2.2uF,10%,0603,16V  C_0603  [C0603]
C357  2.2uF,10%,0603,16V  C_0603  [C0603]
C358  100nF,10%,0402,50V  C_0402  [C0402]
C359  100nF,10%,0402,50V  C_0402  [C0402]
C360  100nF,10%,0402,50V  C_0402  [C0402]
C361  100nF,10%,0402,50V  C_0402  [C0402]
C362  100nF,10%,0402,50V  C_0402  [C0402]
C363  10nF,10%,0402,50V  C_0402  [C0402]
C364  10nF,10%,0402,50V  C_0402  [C0402]
C365  470nF,10%,0402,50V  C_0402  [C0402]
FB3  BLM21PG220SN1D  BLM21PG300SN1D  [L0805]
IC23  AUAV-L60D-M25125-RR-N  AUAV  [AUAV]
IC24  MAGI2C  [MAGI2C]
IC25  NOPOP  ASM330LHBG1  [LGA-14L]
IC26  NOPOP  ICM-40609-D  [LGA-24]
IC27  NOPOP  IAM-20680HT  [LGA-16]
IC28  BMI088  [BMI088]
L14  SEN-Z-F  [SEN-Z-F]
L15  SEN-XY-F  [SEN-XY-F]
L16  SEN-XY-F  [SEN-XY-F]
PCB2  RM3100  EXTERNAL-PCB-COMPONENTS  [VOID]
R217  10K,1%,0402  R_0402  [R0402]
R218  4.7K,1%,0402  R_0402  [R0402]
R219  4.7K,1%,0402  R_0402  [R0402]
R220  4.7K,1%,0402  R_0402  [R0402]
R221  4.7K,1%,0402  R_0402  [R0402]
R222  33K,0.1%,0402  R_0402  [R0402]
R223  10K,1%,0402  R_0402  [R0402]
R224  33,1%,0201  R_0201  [R0201]
R225  33,1%,0201  R_0201  [R0201]
R226  10K,1%,0402  R_0402  [R0402]
R227  4.7K,1%,0402  R_0402  [R0402]
R228  4.7K,1%,0402  R_0402  [R0402]
R229  121,1%,0402  R_0402  [R0402]
R230  121,1% 0402  R_0402  [R0402]
R231  121,1%,0402  R_0402  [R0402]
R232  121,1%,0402  R_0402  [R0402]
R233  121,1%,0402  R_0402  [R0402]
R234  121,1%,0402  R_0402  [R0402]
R235  33,1%,0201  R_0201  [R0201]
R236  33,1%,0201  R_0201  [R0201]
R237  33,1%,0201  R_0201  [R0201]
R238  33,1%,0201  R_0201  [R0201]
R239  33,1%,0201  R_0201  [R0201]
R240  NOPOP  R_0201  [R0201]
R241  NOPOP  R_0402  [R0402]

### Nets
!AUAV-SSA: IC23.4(!SSA) R223.1
!AUAV-SSD: IC23.11(!SSD) R226.1
+3V3: C351.1 C354.2 C355.2 C356.1 C357.1 C358.1 C359.2 C360.2 C361.2 C362.1 C363.1 C364.1 FB3.2 IC23.6(VS) IC25.5(VDDIO) IC25.8(VDD) IC26.8(VDDIO) IC26.13(VDD) IC27.1(VDDIO) IC27.16(VDD) IC28.3(VDD) IC28.11(VDDIO) R217.2 R219.1 R221.1 R223.2 R226.2 R227.1 R228.1 ; also sheet 2,3,4,5,7,8
ASM_SDO: IC25.1(SDO/SA0) R235.1
AUAV-EOC-A: IC23.3(EOC-A) R224.1
AUAV-EOC-D: IC23.10(EOC-D) R225.1
AUAV-TEST: IC23.9(TEST) R217.1
BMI_SDO1: IC28.15(SDO1) R236.1
BMI_SDO2: IC28.10(SDO2) R237.1
EOC_A: R224.2 ; also sheet 4
EOC_D: R225.2 ; also sheet 4
GND: C350.1 C351.2 C352.1 C353.1 C354.1 C355.1 C356.2 C357.2 C358.2 C359.1 C360.1 C361.1 C362.2 C363.2 C364.2 C365.2 IC23.5(GND) IC23.8(GND) IC24.2(RES) IC24.5(AVSS) IC24.19(DVSS) IC24.20(RES) IC25.2(RES) IC25.3(RES) IC25.7(GND) IC26.11(RESV) IC26.18(GND) IC26.20(RESV) IC27.9(RESV) IC27.10(RESV) IC27.11(RESV) IC27.12(RESV) IC27.13(GND) IC27.15(RESV) IC28.2(NC) IC28.4(GNDA) IC28.6(GNDIO) IC28.7(PS) R218.2 R220.2 R222.1 R240.2 R241.1 ; also sheet 1,2,3,4,5,6,7,8
I2C1_SCL: IC23.1(SCL/SCK) R228.2 ; also sheet 4
I2C1_SDA: IC23.2(SDA/MOSI) R227.2 ; also sheet 4
I2C2_SCL: IC24.27(SCLK/SCL) R221.2 ; also sheet 4
I2C2_SDA: IC24.1(MOSI/SDA) R219.2 ; also sheet 4
IAM_SDO: IC27.4(SA0/SDO) R238.1
ICM_SDO: IC26.9(SDO/AD0) R239.1
MAG_3V3: C350.2 C352.2 C353.2 FB3.1 IC24.4(AVDD) IC24.14(DVDD) IC24.22(I2CEN) IC24.26(DVDD)
MAG_REXT: IC24.25(REXT) R222.2
MAG_SA0: IC24.3(SSN/SA0) R218.1
MAG_SA1: IC24.28(MISO/SA1) R220.1
N$3: C365.1 IC27.14(REGOUT)
N$11: IC26.19(INT2/FSYNC) R240.1
SPI5_CS1: IC28.5(CSB2) ; also sheet 4
SPI5_CS3: IC28.14(CSB1) ; also sheet 4
SPI5_MISO: R236.2 R237.2 ; also sheet 4
SPI5_MOSI: IC28.9(SDA/SDI) ; also sheet 4
SPI5_SCK: IC28.8(SCL/SCK) ; also sheet 4
SPI7_CS0: IC25.12(CS) ; also sheet 4
SPI7_CS1: IC26.22(!CS) ; also sheet 4
SPI7_CS2: IC27.5(CS) R241.2 ; also sheet 4
SPI7_MISO: R235.2 R238.2 R239.2 ; also sheet 4
SPI7_MOSI: IC25.14(SDI/SDA) IC26.24(SDA/SDI/SDIO) IC27.3(SDA/SDI) ; also sheet 4
SPI7_SCK: IC25.13(SCK/SCL) IC26.23(SCL/SCLK) IC27.2(SCL/SPC) ; also sheet 4
XDRV_N: IC24.18(XDRVN) R234.2
XDRV_P: IC24.15(XDRVP) R233.2
XIN_N: IC24.17(XINN) L16.P$3 L16.P$4 R234.1
XIN_P: IC24.16(XINP) L16.P$1 L16.P$2 R233.1
YDRV_N: IC24.13(YDRVN) R232.2
YDRV_P: IC24.10(YDRVP) R231.2
YIN_N: IC24.12(YINN) L15.P$3 L15.P$4 R232.1
YIN_P: IC24.11(YINP) L15.P$1 L15.P$2 R231.1
ZDRV_N: IC24.9(ZDRVN) R230.2
ZDRV_P: IC24.6(ZDRVP) R229.2
ZIN_N: IC24.8(ZINN) L14.N L14.P$1 R230.1
ZIN_P: IC24.7(ZINP) L14.P L14.P$3 R229.1
Unconnected: IC23.7(NC) IC23.12(MISO) IC24.21(NC) IC24.23(DRDY) IC24.24(NC) IC25.4(INT1) IC25.6(NC) IC25.9(INT2/DEN) IC25.10(NC) IC25.11(NC) IC26.1(NC) IC26.2(NC) IC26.3(NC) IC26.4(NC) IC26.5(NC) IC26.6(NC) IC26.7(NC) IC26.10(NC) IC26.12(INT1/INT) IC26.14(NC) IC26.15(NC) IC26.16(NC) IC26.17(NC) IC26.21(NC) IC27.6(INT) IC27.7(INT2) IC27.8(FSYNC) IC28.1(INT2) IC28.12(INT3) IC28.13(INT4) IC28.16(INT1)

### Notes on the sheet
- Magnetometer | IMUs
- Address:0x20
- If POP use ASM330LHHXG1
- Design Note:
  Orientation for Z axis is important. Marking shall be on negative pin.
  Orientation for XY axes are irelevant.
- Differential Pressure Sensor
- If POP use ICM-40609-D
- If POP use IAM-20680HT
- Address Diff: 0x26
- Address Abs: 0x27
- BASIC/design/LM.sch
- hw_LM/BASIC
- 1010xx
- jcc5
- abs8